# EAGLE design BigDaddy (EAGLE 8.4.3)
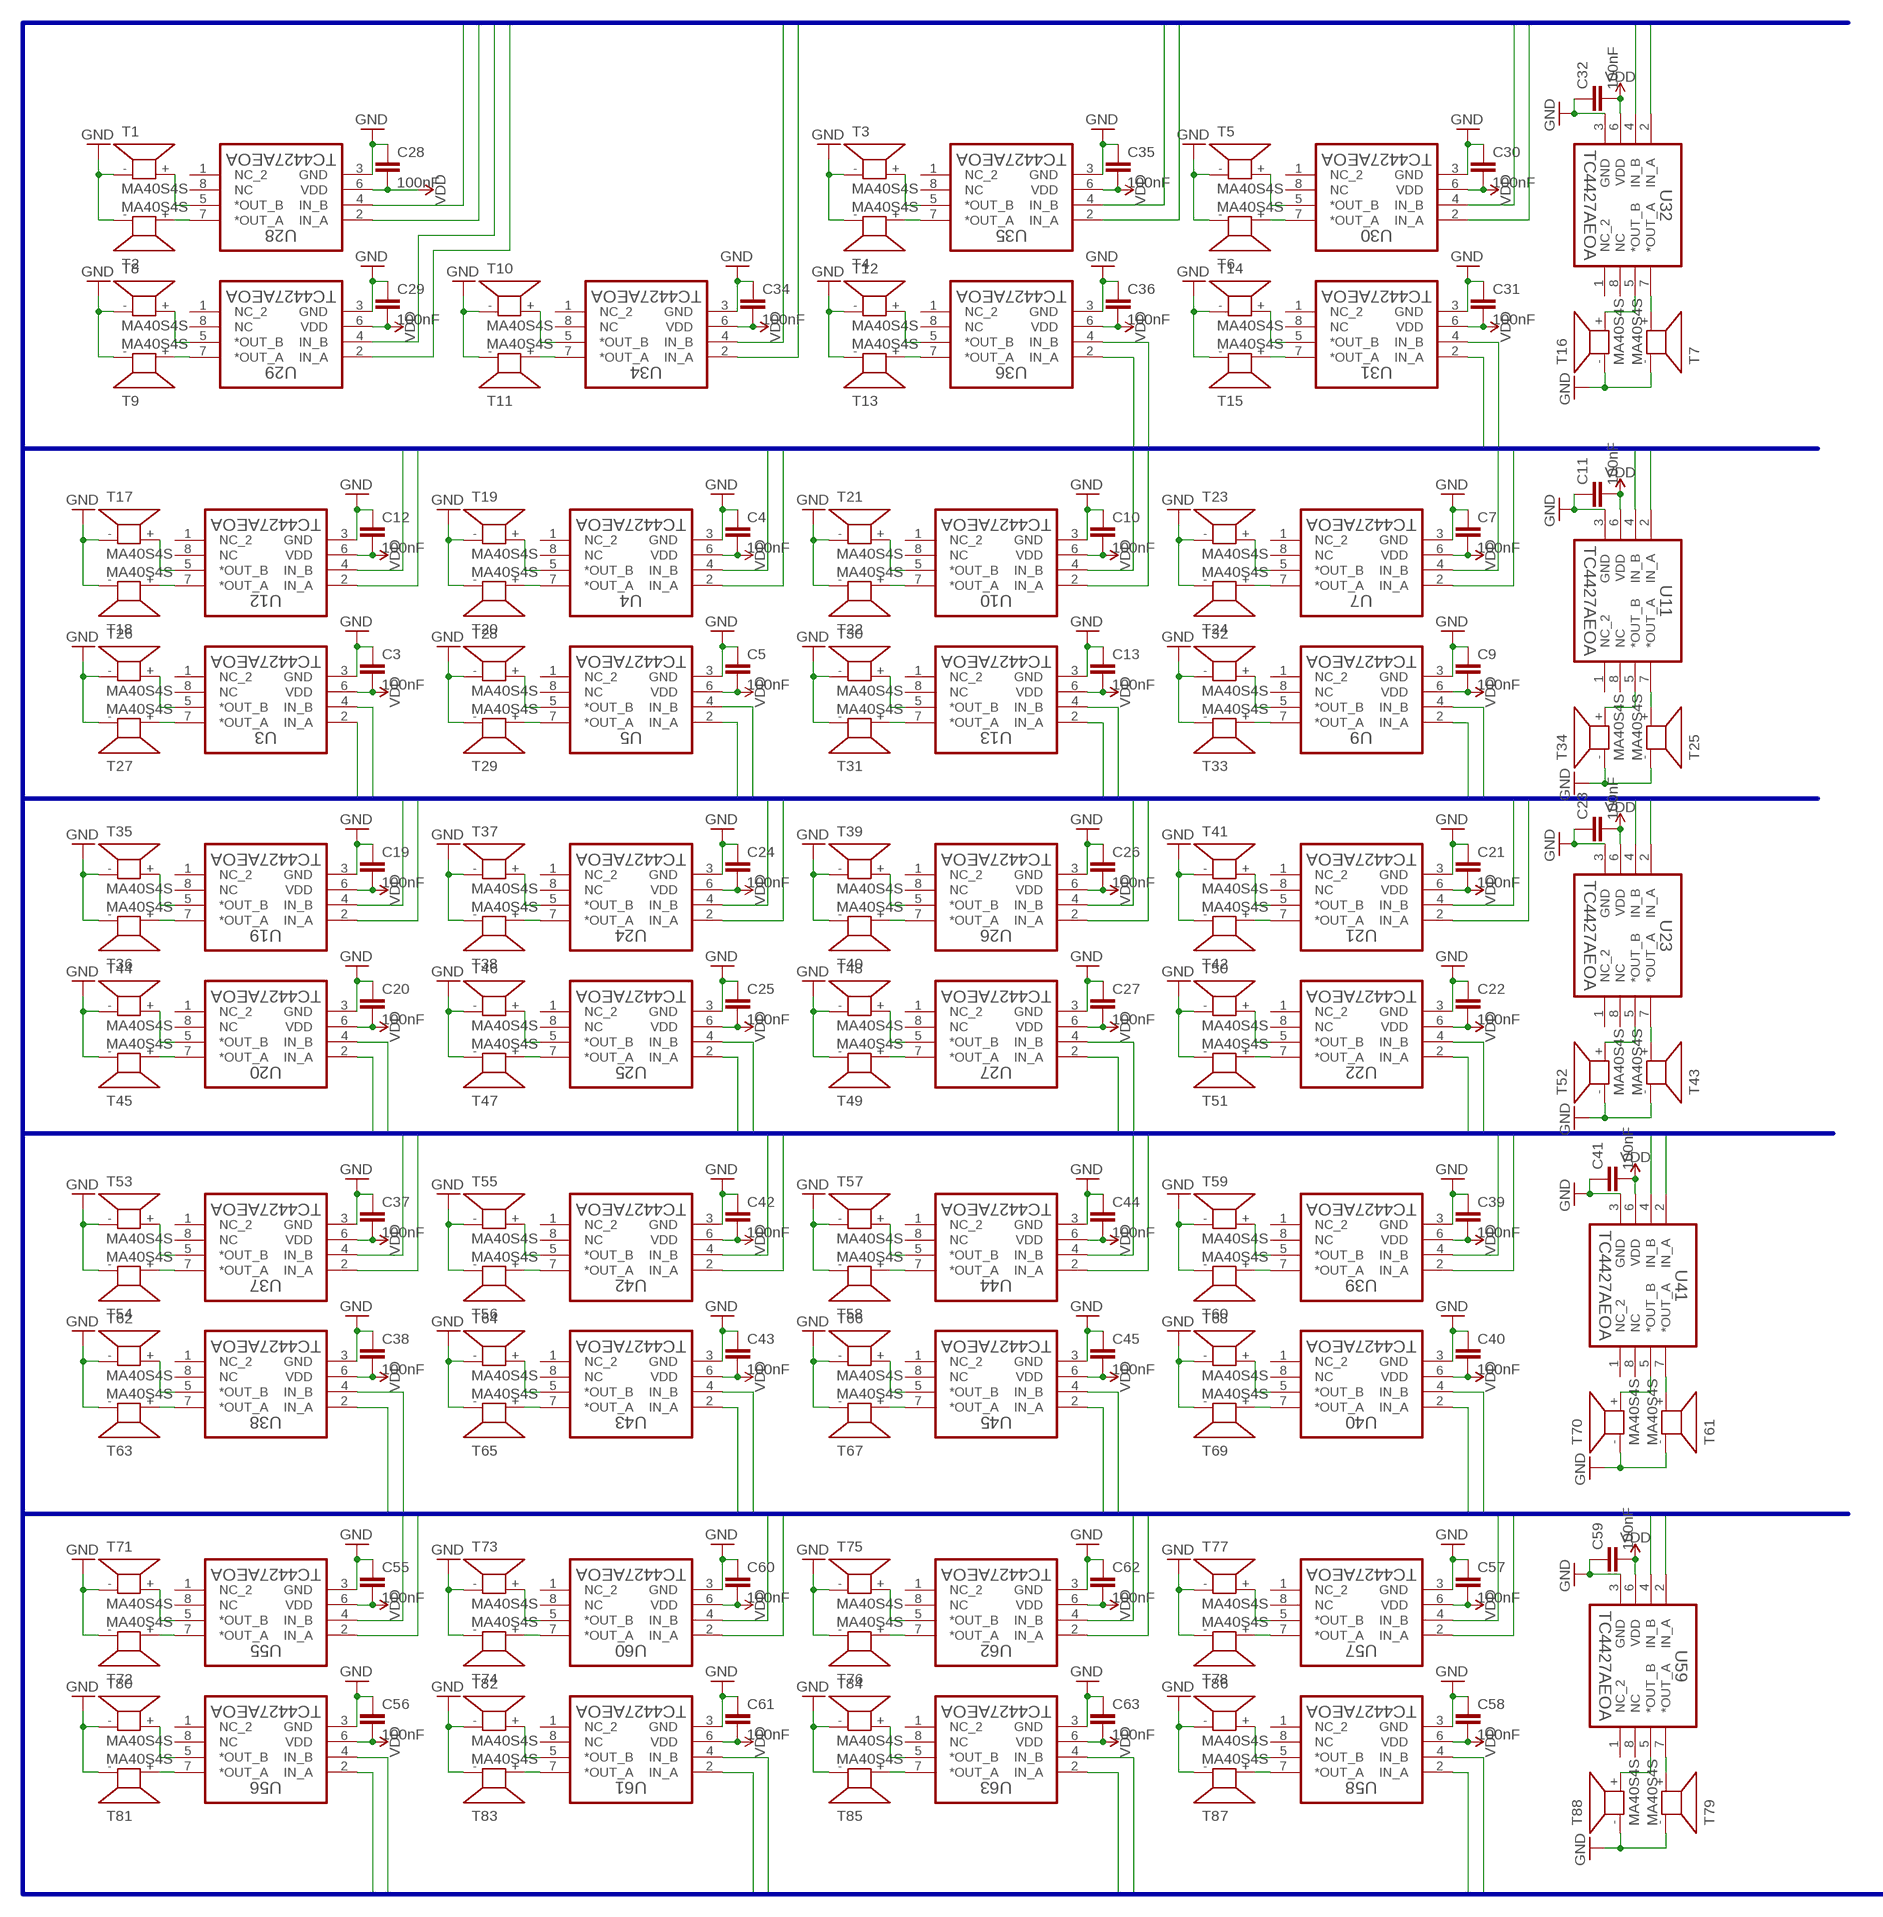
[diagram p0: schematic, sheet 1, part 1 of 2]
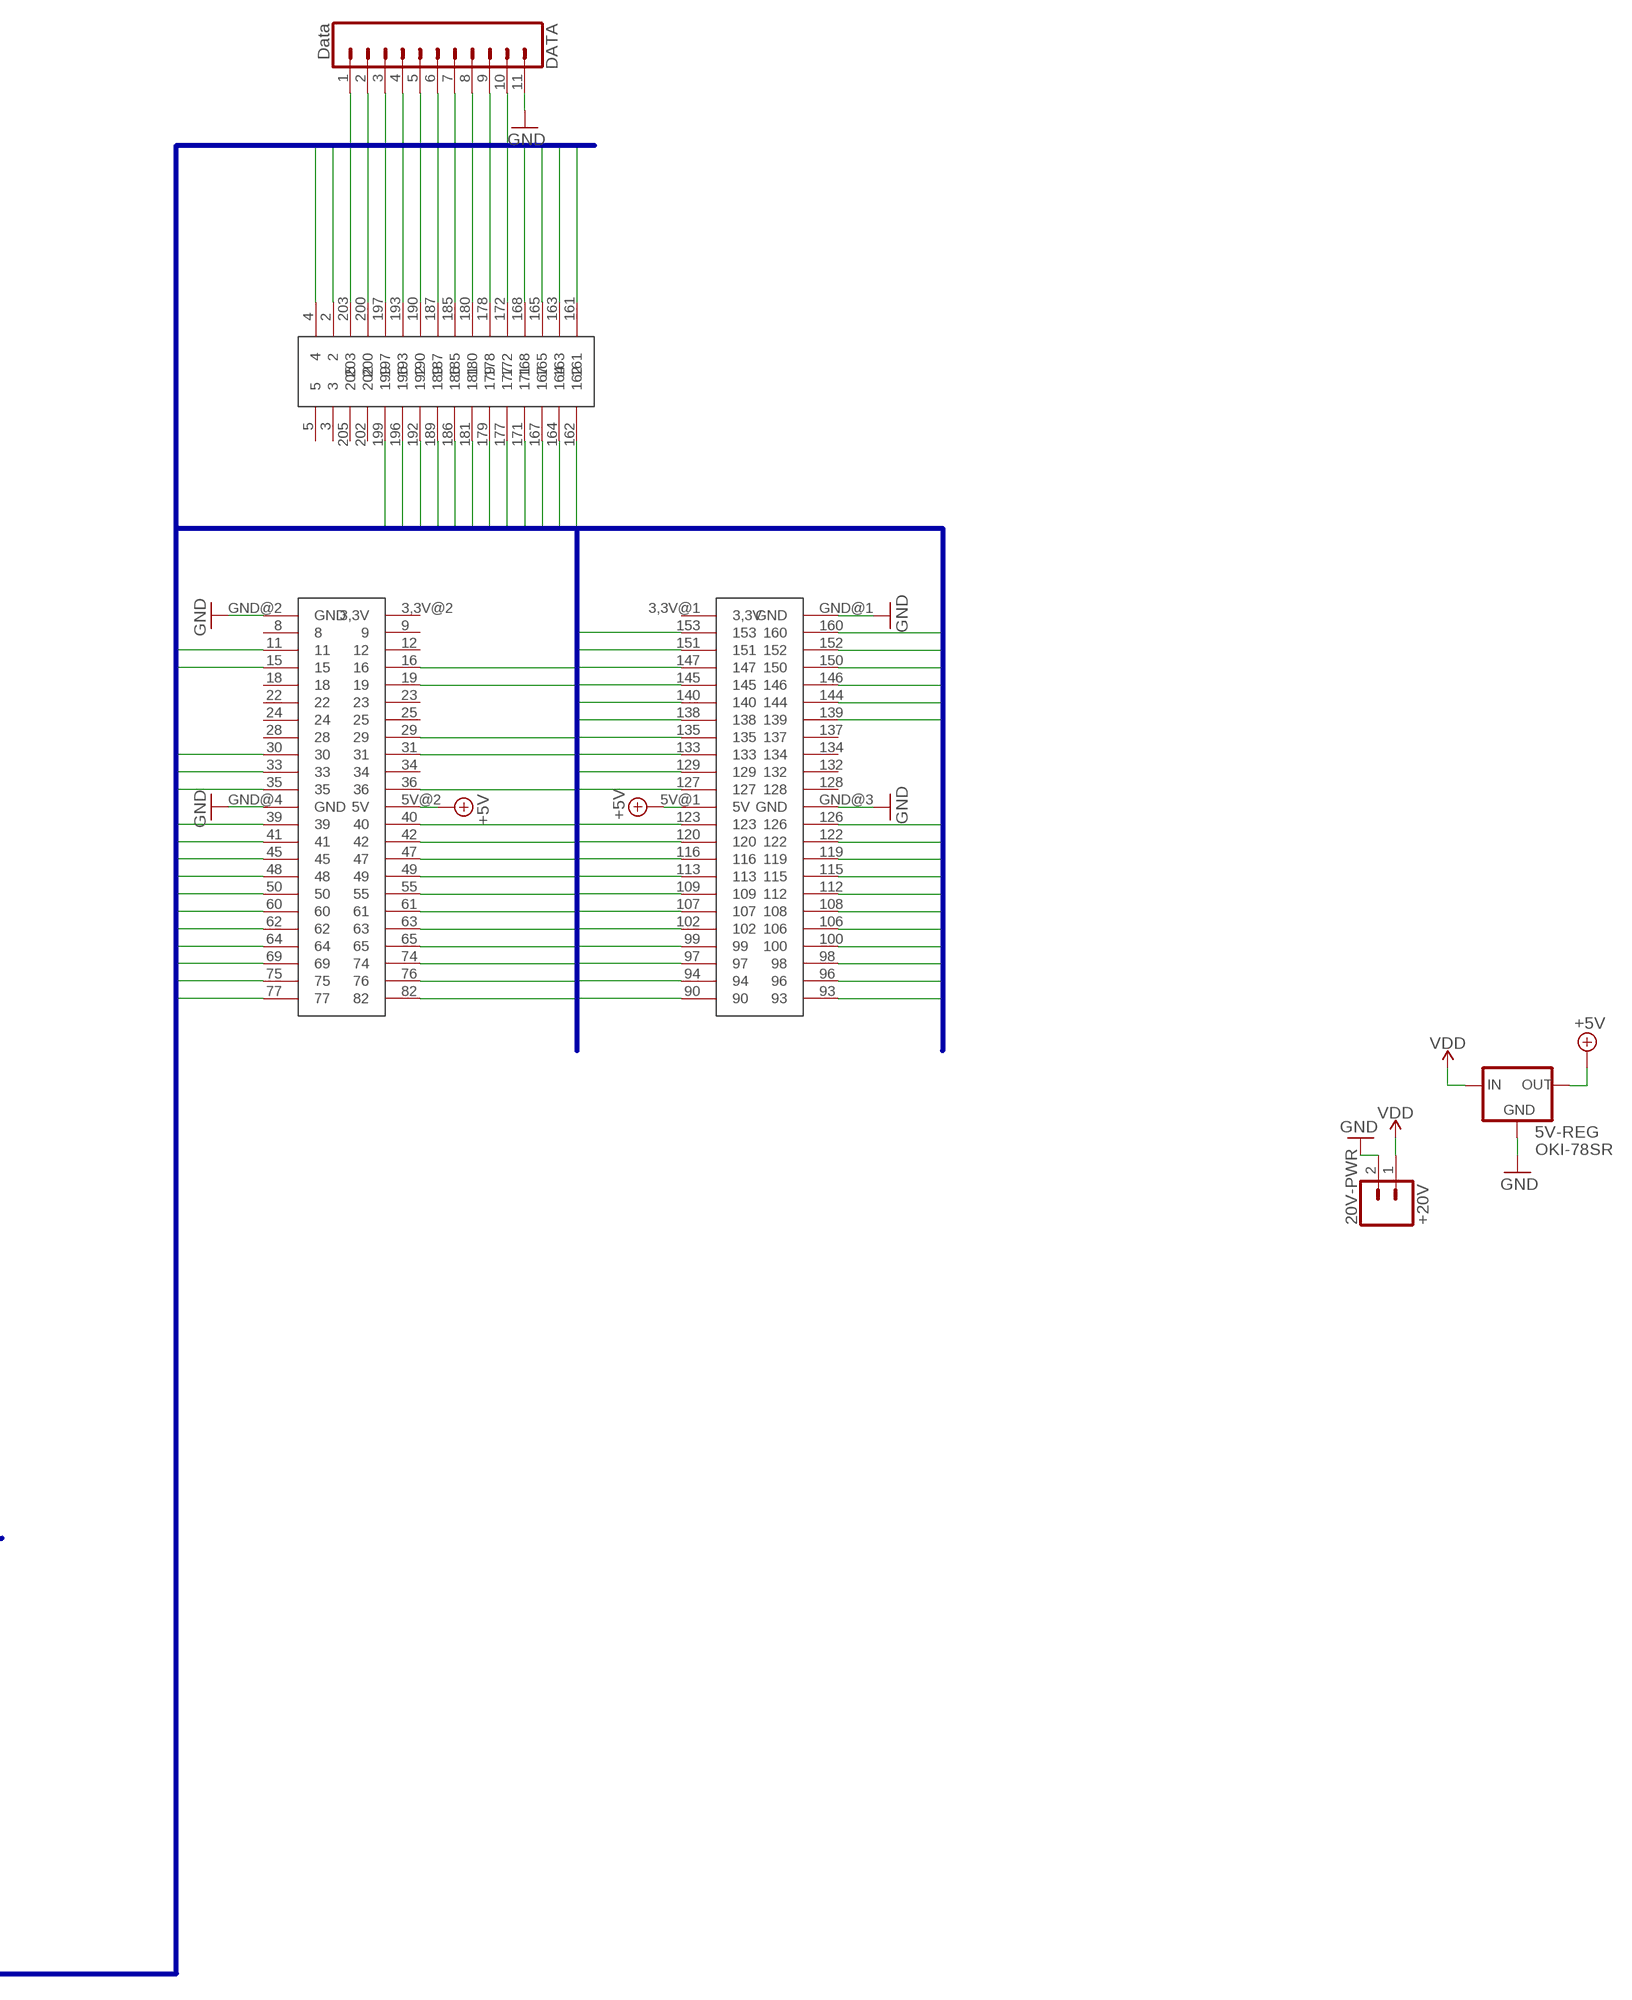
[diagram p1: schematic, sheet 1, part 2 of 2]

## Parts
5V-REG  OKI-78SR  [OKI-78SR-HORIZ]
20V-PWR  +20V  CONN_02LOCK_LONGPADS  [1X02_LOCK_LONGPADS]
C3  100nF  C-EUC0805  [C0805]
C4  100nF  C-EUC0805  [C0805]
C5  100nF  C-EUC0805  [C0805]
C7  100nF  C-EUC0805  [C0805]
C9  100nF  C-EUC0805  [C0805]
C10  100nF  C-EUC0805  [C0805]
C11  100nF  C-EUC0805  [C0805]
C12  100nF  C-EUC0805  [C0805]
C13  100nF  C-EUC0805  [C0805]
C19  100nF  C-EUC0805  [C0805]
C20  100nF  C-EUC0805  [C0805]
C21  100nF  C-EUC0805  [C0805]
C22  100nF  C-EUC0805  [C0805]
C23  100nF  C-EUC0805  [C0805]
C24  100nF  C-EUC0805  [C0805]
C25  100nF  C-EUC0805  [C0805]
C26  100nF  C-EUC0805  [C0805]
C27  100nF  C-EUC0805  [C0805]
C28  100nF  C-EUC0805  [C0805]
C29  100nF  C-EUC0805  [C0805]
C30  100nF  C-EUC0805  [C0805]
C31  100nF  C-EUC0805  [C0805]
C32  100nF  C-EUC0805  [C0805]
C34  100nF  C-EUC0805  [C0805]
C35  100nF  C-EUC0805  [C0805]
C36  100nF  C-EUC0805  [C0805]
C37  100nF  C-EUC0805  [C0805]
C38  100nF  C-EUC0805  [C0805]
C39  100nF  C-EUC0805  [C0805]
C40  100nF  C-EUC0805  [C0805]
C41  100nF  C-EUC0805  [C0805]
C42  100nF  C-EUC0805  [C0805]
C43  100nF  C-EUC0805  [C0805]
C44  100nF  C-EUC0805  [C0805]
C45  100nF  C-EUC0805  [C0805]
C55  100nF  C-EUC0805  [C0805]
C56  100nF  C-EUC0805  [C0805]
C57  100nF  C-EUC0805  [C0805]
C58  100nF  C-EUC0805  [C0805]
C59  100nF  C-EUC0805  [C0805]
C60  100nF  C-EUC0805  [C0805]
C61  100nF  C-EUC0805  [C0805]
C62  100nF  C-EUC0805  [C0805]
C63  100nF  C-EUC0805  [C0805]
DATA  Data  CONN_11  [1X11]
DIP1  CORE3S500ESMT  [CORE3S500E-SMT]
T1  MA40S4S  [MA40]
T2  MA40S4S  [MA40]
T3  MA40S4S  [MA40]
T4  MA40S4S  [MA40]
T5  MA40S4S  [MA40]
T6  MA40S4S  [MA40]
T7  MA40S4S  [MA40]
T8  MA40S4S  [MA40]
T9  MA40S4S  [MA40]
T10  MA40S4S  [MA40]
T11  MA40S4S  [MA40]
T12  MA40S4S  [MA40]
T13  MA40S4S  [MA40]
T14  MA40S4S  [MA40]
T15  MA40S4S  [MA40]
T16  MA40S4S  [MA40]
T17  MA40S4S  [MA40]
T18  MA40S4S  [MA40]
T19  MA40S4S  [MA40]
T20  MA40S4S  [MA40]
T21  MA40S4S  [MA40]
T22  MA40S4S  [MA40]
T23  MA40S4S  [MA40]
T24  MA40S4S  [MA40]
T25  MA40S4S  [MA40]
T26  MA40S4S  [MA40]
T27  MA40S4S  [MA40]
T28  MA40S4S  [MA40]
T29  MA40S4S  [MA40]
T30  MA40S4S  [MA40]
T31  MA40S4S  [MA40]
T32  MA40S4S  [MA40]
T33  MA40S4S  [MA40]
T34  MA40S4S  [MA40]
T35  MA40S4S  [MA40]
T36  MA40S4S  [MA40]
T37  MA40S4S  [MA40]
T38  MA40S4S  [MA40]
T39  MA40S4S  [MA40]
T40  MA40S4S  [MA40]
T41  MA40S4S  [MA40]
T42  MA40S4S  [MA40]
T43  MA40S4S  [MA40]
T44  MA40S4S  [MA40]
T45  MA40S4S  [MA40]
T46  MA40S4S  [MA40]
T47  MA40S4S  [MA40]
T48  MA40S4S  [MA40]
T49  MA40S4S  [MA40]
T50  MA40S4S  [MA40]
T51  MA40S4S  [MA40]
T52  MA40S4S  [MA40]
T53  MA40S4S  [MA40]
T54  MA40S4S  [MA40]
T55  MA40S4S  [MA40]
T56  MA40S4S  [MA40]
T57  MA40S4S  [MA40]
T58  MA40S4S  [MA40]
T59  MA40S4S  [MA40]
T60  MA40S4S  [MA40]
T61  MA40S4S  [MA40]
T62  MA40S4S  [MA40]
T63  MA40S4S  [MA40]
T64  MA40S4S  [MA40]
T65  MA40S4S  [MA40]
T66  MA40S4S  [MA40]
T67  MA40S4S  [MA40]
T68  MA40S4S  [MA40]
T69  MA40S4S  [MA40]
T70  MA40S4S  [MA40]
T71  MA40S4S  [MA40]
T72  MA40S4S  [MA40]
T73  MA40S4S  [MA40]
T74  MA40S4S  [MA40]
T75  MA40S4S  [MA40]
T76  MA40S4S  [MA40]
T77  MA40S4S  [MA40]
T78  MA40S4S  [MA40]
T79  MA40S4S  [MA40]
T80  MA40S4S  [MA40]
T81  MA40S4S  [MA40]
T82  MA40S4S  [MA40]
T83  MA40S4S  [MA40]
T84  MA40S4S  [MA40]
T85  MA40S4S  [MA40]
T86  MA40S4S  [MA40]
T87  MA40S4S  [MA40]
T88  MA40S4S  [MA40]
U3  TC4427AEOA  [SOIC127P600X175-8N]
U4  TC4427AEOA  [SOIC127P600X175-8N]
U5  TC4427AEOA  [SOIC127P600X175-8N]
U7  TC4427AEOA  [SOIC127P600X175-8N]
U9  TC4427AEOA  [SOIC127P600X175-8N]
U10  TC4427AEOA  [SOIC127P600X175-8N]
U11  TC4427AEOA  [SOIC127P600X175-8N]
U12  TC4427AEOA  [SOIC127P600X175-8N]
U13  TC4427AEOA  [SOIC127P600X175-8N]
U19  TC4427AEOA  [SOIC127P600X175-8N]
U20  TC4427AEOA  [SOIC127P600X175-8N]
U21  TC4427AEOA  [SOIC127P600X175-8N]
U22  TC4427AEOA  [SOIC127P600X175-8N]
U23  TC4427AEOA  [SOIC127P600X175-8N]
U24  TC4427AEOA  [SOIC127P600X175-8N]
U25  TC4427AEOA  [SOIC127P600X175-8N]
U26  TC4427AEOA  [SOIC127P600X175-8N]
U27  TC4427AEOA  [SOIC127P600X175-8N]
U28  TC4427AEOA  [SOIC127P600X175-8N]
U29  TC4427AEOA  [SOIC127P600X175-8N]
U30  TC4427AEOA  [SOIC127P600X175-8N]
U31  TC4427AEOA  [SOIC127P600X175-8N]
U32  TC4427AEOA  [SOIC127P600X175-8N]
U34  TC4427AEOA  [SOIC127P600X175-8N]
U35  TC4427AEOA  [SOIC127P600X175-8N]
U36  TC4427AEOA  [SOIC127P600X175-8N]
U37  TC4427AEOA  [SOIC127P600X175-8N]
U38  TC4427AEOA  [SOIC127P600X175-8N]
U39  TC4427AEOA  [SOIC127P600X175-8N]
U40  TC4427AEOA  [SOIC127P600X175-8N]
U41  TC4427AEOA  [SOIC127P600X175-8N]
U42  TC4427AEOA  [SOIC127P600X175-8N]
U43  TC4427AEOA  [SOIC127P600X175-8N]
U44  TC4427AEOA  [SOIC127P600X175-8N]
U45  TC4427AEOA  [SOIC127P600X175-8N]
U55  TC4427AEOA  [SOIC127P600X175-8N]
U56  TC4427AEOA  [SOIC127P600X175-8N]
U57  TC4427AEOA  [SOIC127P600X175-8N]
U58  TC4427AEOA  [SOIC127P600X175-8N]
U59  TC4427AEOA  [SOIC127P600X175-8N]
U60  TC4427AEOA  [SOIC127P600X175-8N]
U61  TC4427AEOA  [SOIC127P600X175-8N]
U62  TC4427AEOA  [SOIC127P600X175-8N]
U63  TC4427AEOA  [SOIC127P600X175-8N]

## Nets
1: DIP1.2 U28.4(IN_B)
2: DIP1.4 U28.2(IN_A)
3: DIP1.165 U35.4(IN_B)
4: DIP1.168 U35.2(IN_A)
5: DIP1.163 U30.4(IN_B)
6: DIP1.161 U30.2(IN_A)
7: DIP1.162 U32.2(IN_A)
8: DIP1.196 U29.4(IN_B)
9: DIP1.199 U29.2(IN_A)
10: DIP1.192 U34.4(IN_B)
11: DIP1.189 U34.2(IN_A)
12: DIP1.177 U36.4(IN_B)
13: DIP1.179 U36.2(IN_A)
14: DIP1.171 U31.4(IN_B)
15: DIP1.167 U31.2(IN_A)
16: DIP1.164 U32.4(IN_B)
17: DIP1.11 U12.4(IN_B)
18: DIP1.15 U12.2(IN_A)
19: DIP1.19 U4.4(IN_B)
20: DIP1.16 U4.2(IN_A)
21: DIP1.186 U10.4(IN_B)
22: DIP1.181 U10.2(IN_A)
23: DIP1.152 U7.4(IN_B)
24: DIP1.160 U7.2(IN_A)
25: DIP1.150 U11.2(IN_A)
26: DIP1.30 U3.4(IN_B)
27: DIP1.33 U3.2(IN_A)
28: DIP1.31 U5.4(IN_B)
29: DIP1.29 U5.2(IN_A)
30: DIP1.153 U13.4(IN_B)
31: DIP1.151 U13.2(IN_A)
32: DIP1.139 U9.4(IN_B)
33: DIP1.144 U9.2(IN_A)
34: DIP1.146 U11.4(IN_B)
35: DIP1.35 U19.4(IN_B)
36: DIP1.39 U19.2(IN_A)
37: DIP1.40 U24.4(IN_B)
38: DIP1.36 U24.2(IN_A)
39: DIP1.147 U26.4(IN_B)
40: DIP1.145 U26.2(IN_A)
41: DIP1.122 U21.4(IN_B)
42: DIP1.126 U21.2(IN_A)
43: DIP1.119 U23.2(IN_A)
44: DIP1.41 U20.4(IN_B)
45: DIP1.45 U20.2(IN_A)
46: DIP1.47 U25.4(IN_B)
47: DIP1.42 U25.2(IN_A)
48: DIP1.140 U27.4(IN_B)
49: DIP1.138 U27.2(IN_A)
50: DIP1.108 U22.4(IN_B)
51: DIP1.112 U22.2(IN_A)
52: DIP1.115 U23.4(IN_B)
53: DIP1.48 U37.4(IN_B)
54: DIP1.50 U37.2(IN_A)
55: DIP1.55 U42.4(IN_B)
56: DIP1.49 U42.2(IN_A)
57: DIP1.135 U44.4(IN_B)
58: DIP1.133 U44.2(IN_A)
59: DIP1.100 U39.4(IN_B)
60: DIP1.106 U39.2(IN_A)
61: DIP1.98 U41.2(IN_A)
62: DIP1.77 U38.4(IN_B)
63: DIP1.75 U38.2(IN_A)
64: DIP1.63 U43.4(IN_B)
65: DIP1.61 U43.2(IN_A)
66: DIP1.129 U45.4(IN_B)
67: DIP1.127 U45.2(IN_A)
68: DIP1.109 U40.4(IN_B)
69: DIP1.93 U40.2(IN_A)
70: DIP1.96 U41.4(IN_B)
71: DIP1.69 U55.4(IN_B)
72: DIP1.64 U55.2(IN_A)
73: DIP1.74 U60.4(IN_B)
74: DIP1.65 U60.2(IN_A)
75: DIP1.123 U62.4(IN_B)
76: DIP1.120 U62.2(IN_A)
77: DIP1.102 U57.4(IN_B)
78: DIP1.107 U57.2(IN_A)
79: DIP1.99 U59.2(IN_A)
80: DIP1.62 U56.4(IN_B)
81: DIP1.60 U56.2(IN_A)
82: DIP1.82 U61.4(IN_B)
83: DIP1.76 U61.2(IN_A)
84: DIP1.116 U63.4(IN_B)
85: DIP1.113 U63.2(IN_A)
86: DIP1.94 U58.4(IN_B)
87: DIP1.90 U58.2(IN_A)
88: DIP1.97 U59.4(IN_B)
+5V: 5V-REG.OUT DIP1.5V@1(5V) DIP1.5V@2(5V)
GND: 5V-REG.GND 20V-PWR.2 C3.1 C4.1 C5.1 C7.1 C9.1 C10.1 C11.1 C12.1 C13.1 C19.1 C20.1 C21.1 C22.1 C23.1 C24.1 C25.1 C26.1 C27.1 C28.1 C29.1 C30.1 C31.1 C32.1 C34.1 C35.1 C36.1 C37.1 C38.1 C39.1 C40.1 C41.1 C42.1 C43.1 C44.1 C45.1 C55.1 C56.1 C57.1 C58.1 C59.1 C60.1 C61.1 C62.1 C63.1 DATA.11 DIP1.GND@1(GND) DIP1.GND@2(GND) DIP1.GND@3(GND) DIP1.GND@4(GND) T1.- T2.- T3.- T4.- T5.- T6.- T7.- T8.- T9.- T10.- T11.- T12.- T13.- T14.- T15.- T16.- T17.- T18.- T19.- T20.- T21.- T22.- T23.- T24.- T25.- T26.- T27.- T28.- T29.- T30.- T31.- T32.- T33.- T34.- T35.- T36.- T37.- T38.- T39.- T40.- T41.- T42.- T43.- T44.- T45.- T46.- T47.- T48.- T49.- T50.- T51.- T52.- T53.- T54.- T55.- T56.- T57.- T58.- T59.- T60.- T61.- T62.- T63.- T64.- T65.- T66.- T67.- T68.- T69.- T70.- T71.- T72.- T73.- T74.- T75.- T76.- T77.- T78.- T79.- T80.- T81.- T82.- T83.- T84.- T85.- T86.- T87.- T88.- U3.3(GND) U4.3(GND) U5.3(GND) U7.3(GND) U9.3(GND) U10.3(GND) U11.3(GND) U12.3(GND) U13.3(GND) U19.3(GND) U20.3(GND) U21.3(GND) U22.3(GND) U23.3(GND) U24.3(GND) U25.3(GND) U26.3(GND) U27.3(GND) U28.3(GND) U29.3(GND) U30.3(GND) U31.3(GND) U32.3(GND) U34.3(GND) U35.3(GND) U36.3(GND) U37.3(GND) U38.3(GND) U39.3(GND) U40.3(GND) U41.3(GND) U42.3(GND) U43.3(GND) U44.3(GND) U45.3(GND) U55.3(GND) U56.3(GND) U57.3(GND) U58.3(GND) U59.3(GND) U60.3(GND) U61.3(GND) U62.3(GND) U63.3(GND)
N$1: DATA.1 DIP1.203
N$2: DATA.2 DIP1.200
N$3: DATA.3 DIP1.197
N$4: DATA.4 DIP1.193
N$5: T27.+ U3.7(*OUT_A)
N$6: T26.+ U3.5(*OUT_B)
N$7: T20.+ U4.7(*OUT_A)
N$8: T19.+ U4.5(*OUT_B)
N$9: T29.+ U5.7(*OUT_A)
N$10: T28.+ U5.5(*OUT_B)
N$13: DATA.5 DIP1.190
N$14: DATA.6 DIP1.187
N$15: T24.+ U7.7(*OUT_A)
N$16: T23.+ U7.5(*OUT_B)
N$17: DATA.7 DIP1.185
N$18: DATA.8 DIP1.180
N$19: T33.+ U9.7(*OUT_A)
N$20: T32.+ U9.5(*OUT_B)
N$21: T22.+ U10.7(*OUT_A)
N$22: T21.+ U10.5(*OUT_B)
N$23: T25.+ U11.7(*OUT_A)
N$24: T34.+ U11.5(*OUT_B)
N$25: T18.+ U12.7(*OUT_A)
N$26: T17.+ U12.5(*OUT_B)
N$27: T31.+ U13.7(*OUT_A)
N$28: T30.+ U13.5(*OUT_B)
N$29: DATA.9 DIP1.178
N$30: DATA.10 DIP1.172
N$39: T36.+ U19.7(*OUT_A)
N$40: T35.+ U19.5(*OUT_B)
N$41: T45.+ U20.7(*OUT_A)
N$42: T44.+ U20.5(*OUT_B)
N$43: T42.+ U21.7(*OUT_A)
N$44: T41.+ U21.5(*OUT_B)
N$45: T51.+ U22.7(*OUT_A)
N$46: T50.+ U22.5(*OUT_B)
N$47: T43.+ U23.7(*OUT_A)
N$48: T52.+ U23.5(*OUT_B)
N$49: T38.+ U24.7(*OUT_A)
N$50: T37.+ U24.5(*OUT_B)
N$51: T47.+ U25.7(*OUT_A)
N$52: T46.+ U25.5(*OUT_B)
N$53: T40.+ U26.7(*OUT_A)
N$54: T39.+ U26.5(*OUT_B)
N$55: T49.+ U27.7(*OUT_A)
N$56: T48.+ U27.5(*OUT_B)
N$57: T2.+ U28.7(*OUT_A)
N$58: T1.+ U28.5(*OUT_B)
N$59: T9.+ U29.7(*OUT_A)
N$60: T8.+ U29.5(*OUT_B)
N$61: T6.+ U30.7(*OUT_A)
N$62: T5.+ U30.5(*OUT_B)
N$63: T15.+ U31.7(*OUT_A)
N$64: T14.+ U31.5(*OUT_B)
N$65: T7.+ U32.7(*OUT_A)
N$66: T16.+ U32.5(*OUT_B)
N$69: T11.+ U34.7(*OUT_A)
N$70: T10.+ U34.5(*OUT_B)
N$71: T4.+ U35.7(*OUT_A)
N$72: T3.+ U35.5(*OUT_B)
N$73: T13.+ U36.7(*OUT_A)
N$74: T12.+ U36.5(*OUT_B)
N$75: T54.+ U37.7(*OUT_A)
N$76: T53.+ U37.5(*OUT_B)
N$77: T63.+ U38.7(*OUT_A)
N$78: T62.+ U38.5(*OUT_B)
N$79: T60.+ U39.7(*OUT_A)
N$80: T59.+ U39.5(*OUT_B)
N$81: T69.+ U40.7(*OUT_A)
N$82: T68.+ U40.5(*OUT_B)
N$83: T61.+ U41.7(*OUT_A)
N$84: T70.+ U41.5(*OUT_B)
N$85: T56.+ U42.7(*OUT_A)
N$86: T55.+ U42.5(*OUT_B)
N$87: T65.+ U43.7(*OUT_A)
N$88: T64.+ U43.5(*OUT_B)
N$89: T58.+ U44.7(*OUT_A)
N$90: T57.+ U44.5(*OUT_B)
N$91: T67.+ U45.7(*OUT_A)
N$92: T66.+ U45.5(*OUT_B)
N$111: T72.+ U55.7(*OUT_A)
N$112: T71.+ U55.5(*OUT_B)
N$113: T81.+ U56.7(*OUT_A)
N$114: T80.+ U56.5(*OUT_B)
N$115: T78.+ U57.7(*OUT_A)
N$116: T77.+ U57.5(*OUT_B)
N$117: T87.+ U58.7(*OUT_A)
N$118: T86.+ U58.5(*OUT_B)
N$119: T79.+ U59.7(*OUT_A)
N$120: T88.+ U59.5(*OUT_B)
N$121: T74.+ U60.7(*OUT_A)
N$122: T73.+ U60.5(*OUT_B)
N$123: T83.+ U61.7(*OUT_A)
N$124: T82.+ U61.5(*OUT_B)
N$125: T76.+ U62.7(*OUT_A)
N$126: T75.+ U62.5(*OUT_B)
N$127: T85.+ U63.7(*OUT_A)
N$128: T84.+ U63.5(*OUT_B)
VDD: 5V-REG.IN 20V-PWR.1 C3.2 C4.2 C5.2 C7.2 C9.2 C10.2 C11.2 C12.2 C13.2 C19.2 C20.2 C21.2 C22.2 C23.2 C24.2 C25.2 C26.2 C27.2 C28.2 C29.2 C30.2 C31.2 C32.2 C34.2 C35.2 C36.2 C37.2 C38.2 C39.2 C40.2 C41.2 C42.2 C43.2 C44.2 C45.2 C55.2 C56.2 C57.2 C58.2 C59.2 C60.2 C61.2 C62.2 C63.2 U3.6(VDD) U4.6(VDD) U5.6(VDD) U7.6(VDD) U9.6(VDD) U10.6(VDD) U11.6(VDD) U12.6(VDD) U13.6(VDD) U19.6(VDD) U20.6(VDD) U21.6(VDD) U22.6(VDD) U23.6(VDD) U24.6(VDD) U25.6(VDD) U26.6(VDD) U27.6(VDD) U28.6(VDD) U29.6(VDD) U30.6(VDD) U31.6(VDD) U32.6(VDD) U34.6(VDD) U35.6(VDD) U36.6(VDD) U37.6(VDD) U38.6(VDD) U39.6(VDD) U40.6(VDD) U41.6(VDD) U42.6(VDD) U43.6(VDD) U44.6(VDD) U45.6(VDD) U55.6(VDD) U56.6(VDD) U57.6(VDD) U58.6(VDD) U59.6(VDD) U60.6(VDD) U61.6(VDD) U62.6(VDD) U63.6(VDD)
Unconnected: DIP1.3 DIP1.3,3V@1(3,3V) DIP1.3,3V@2(3,3V) DIP1.5 DIP1.8 DIP1.9 DIP1.12 DIP1.18 DIP1.22 DIP1.23 DIP1.24 DIP1.25 DIP1.28 DIP1.34 DIP1.128 DIP1.132 DIP1.134 DIP1.137 DIP1.202 DIP1.205 U3.1(NC_2) U3.8(NC) U4.1(NC_2) U4.8(NC) U5.1(NC_2) U5.8(NC) U7.1(NC_2) U7.8(NC) U9.1(NC_2) U9.8(NC) U10.1(NC_2) U10.8(NC) U11.1(NC_2) U11.8(NC) U12.1(NC_2) U12.8(NC) U13.1(NC_2) U13.8(NC) U19.1(NC_2) U19.8(NC) U20.1(NC_2) U20.8(NC) U21.1(NC_2) U21.8(NC) U22.1(NC_2) U22.8(NC) U23.1(NC_2) U23.8(NC) U24.1(NC_2) U24.8(NC) U25.1(NC_2) U25.8(NC) U26.1(NC_2) U26.8(NC) U27.1(NC_2) U27.8(NC) U28.1(NC_2) U28.8(NC) U29.1(NC_2) U29.8(NC) U30.1(NC_2) U30.8(NC) U31.1(NC_2) U31.8(NC) U32.1(NC_2) U32.8(NC) U34.1(NC_2) U34.8(NC) U35.1(NC_2) U35.8(NC) U36.1(NC_2) U36.8(NC) U37.1(NC_2) U37.8(NC) U38.1(NC_2) U38.8(NC) U39.1(NC_2) U39.8(NC) U40.1(NC_2) U40.8(NC) U41.1(NC_2) U41.8(NC) U42.1(NC_2) U42.8(NC) U43.1(NC_2) U43.8(NC) U44.1(NC_2) U44.8(NC) U45.1(NC_2) U45.8(NC) U55.1(NC_2) U55.8(NC) U56.1(NC_2) U56.8(NC) U57.1(NC_2) U57.8(NC) U58.1(NC_2) U58.8(NC) U59.1(NC_2) U59.8(NC) U60.1(NC_2) U60.8(NC) U61.1(NC_2) U61.8(NC) U62.1(NC_2) U62.8(NC) U63.1(NC_2) U63.8(NC)

## Buses
1,2,3,4,5,6,7,8,9,10,11,12,13,14,15,16,17,18,19,20,21,22,23,24,25,26,27,28,29,30,31,32,33,34,35,36,37,38,39,40,41,42,43,44,45,46,47,48,49,50,51,52,53,54,55,56,57,58,59,60,61,62,63,64,65,66,67,68,69,70,71,72,73,74,75,76,77,78,79,80,81,82,83,84,85,86,87,88

## Library data of the parts
5V-REG = Parts:OKI-78SR
20V-PWR = SparkFun-Connectors:CONN_02: Multi connection point. Often used as Generic Header-pin footprint for 0.1 inch spaced/style header connections On any of the 0.1 inch spaced packages, you can populate with these: Break Away Headers - Straight <https://www.sparkfun.com/products/116> (PRT-00116) Break Away Male Headers - Right Angle <https://www.sparkfun.com/products/553> (PRT-00553) Female Headers <https://www.sparkfun.com/products/115> (PRT-00115) Break Away Headers - Machine Pin <https://www.sparkfun.com/products/117> (PRT-00117) Break Away Female Headers - Swiss Machine Pin <https://www.sparkfun.com/products/743> (PRT-00743) For SCREWTERMINALS and SPRING TERMINALS visit here: Screw Terimnals on SparkFun.com <https://www.sparkfun.com/search/results?term=Screw+Terminals> (5mm/3.5mm/2.54mm spacing) This device is also useful as a general connection point to wire up your design to another part of your project. Our various solder wires solder well into these plated through hole pads. Hook-Up Wire - Assortment (Stranded, 22 AWG) <https://www.sparkfun.com/products/11375> (PRT-11375) Hook-Up Wire - Assortment (Solid Core, 22 AWG) <https://www.sparkfun.com/products/11367> (PRT-11367) View the entire wire category on our website here <https://www.sparkfun.com/categories/141> Special notes: Molex polarized connector foot print use with: PRT-08233 with associated crimp pins and housings. 2.54_SCREWTERM for use with PRT-10571. 3.5mm Screw Terminal footprints for PRT-08084 5mm Screw Terminal footprints for use with PRT-08432
C3-C5 C7 C9-C13 C19-C32 C34-C45 C55-C63 = resistor:C-EU: CAPACITOR, European symbol
DATA = SparkFun-Connectors:CONN_11: Multi connection point. Often used as Generic Header-pin footprint for 0.1 inch spaced/style header connections On any of the 0.1 inch spaced packages, you can populate with these: Break Away Headers - Straight <https://www.sparkfun.com/products/116> (PRT-00116) Break Away Male Headers - Right Angle <https://www.sparkfun.com/products/553> (PRT-00553) Female Headers <https://www.sparkfun.com/products/115> (PRT-00115) Break Away Headers - Machine Pin <https://www.sparkfun.com/products/117> (PRT-00117) Break Away Female Headers - Swiss Machine Pin <https://www.sparkfun.com/products/743> (PRT-00743) For SCREWTERMINALS and SPRING TERMINALS visit here: Screw Terimnals on SparkFun.com <https://www.sparkfun.com/search/results?term=Screw+Terminals> (5mm/3.5mm/2.54mm spacing) This device is also useful as a general connection point to wire up your design to another part of your project. Our various solder wires solder well into these plated through hole pads. Hook-Up Wire - Assortment (Stranded, 22 AWG) <https://www.sparkfun.com/products/11375> (PRT-11375) Hook-Up Wire - Assortment (Solid Core, 22 AWG) <https://www.sparkfun.com/products/11367> (PRT-11367) View the entire wire category on our website here <https://www.sparkfun.com/categories/141>
DIP1 = Parts:CORE3S500E: A Xilinx Spartan 3E FPGA module.
T1-T88 = Parts:MA40S4S: SPEAKER Source: Buerklin
U3-U5 U7 U9-U13 U19-U32 U34-U45 U55-U63 = Parts:TC4427AEOA: IC, MOSFET DRIVER, LOW SIDE; MPN: TC4427AEOA; OC_FARNELL: 1292285; OC_NEWARK: 96K4020; PACKAGE: SOIC-8; SUPPLIER: Microchip

## Board
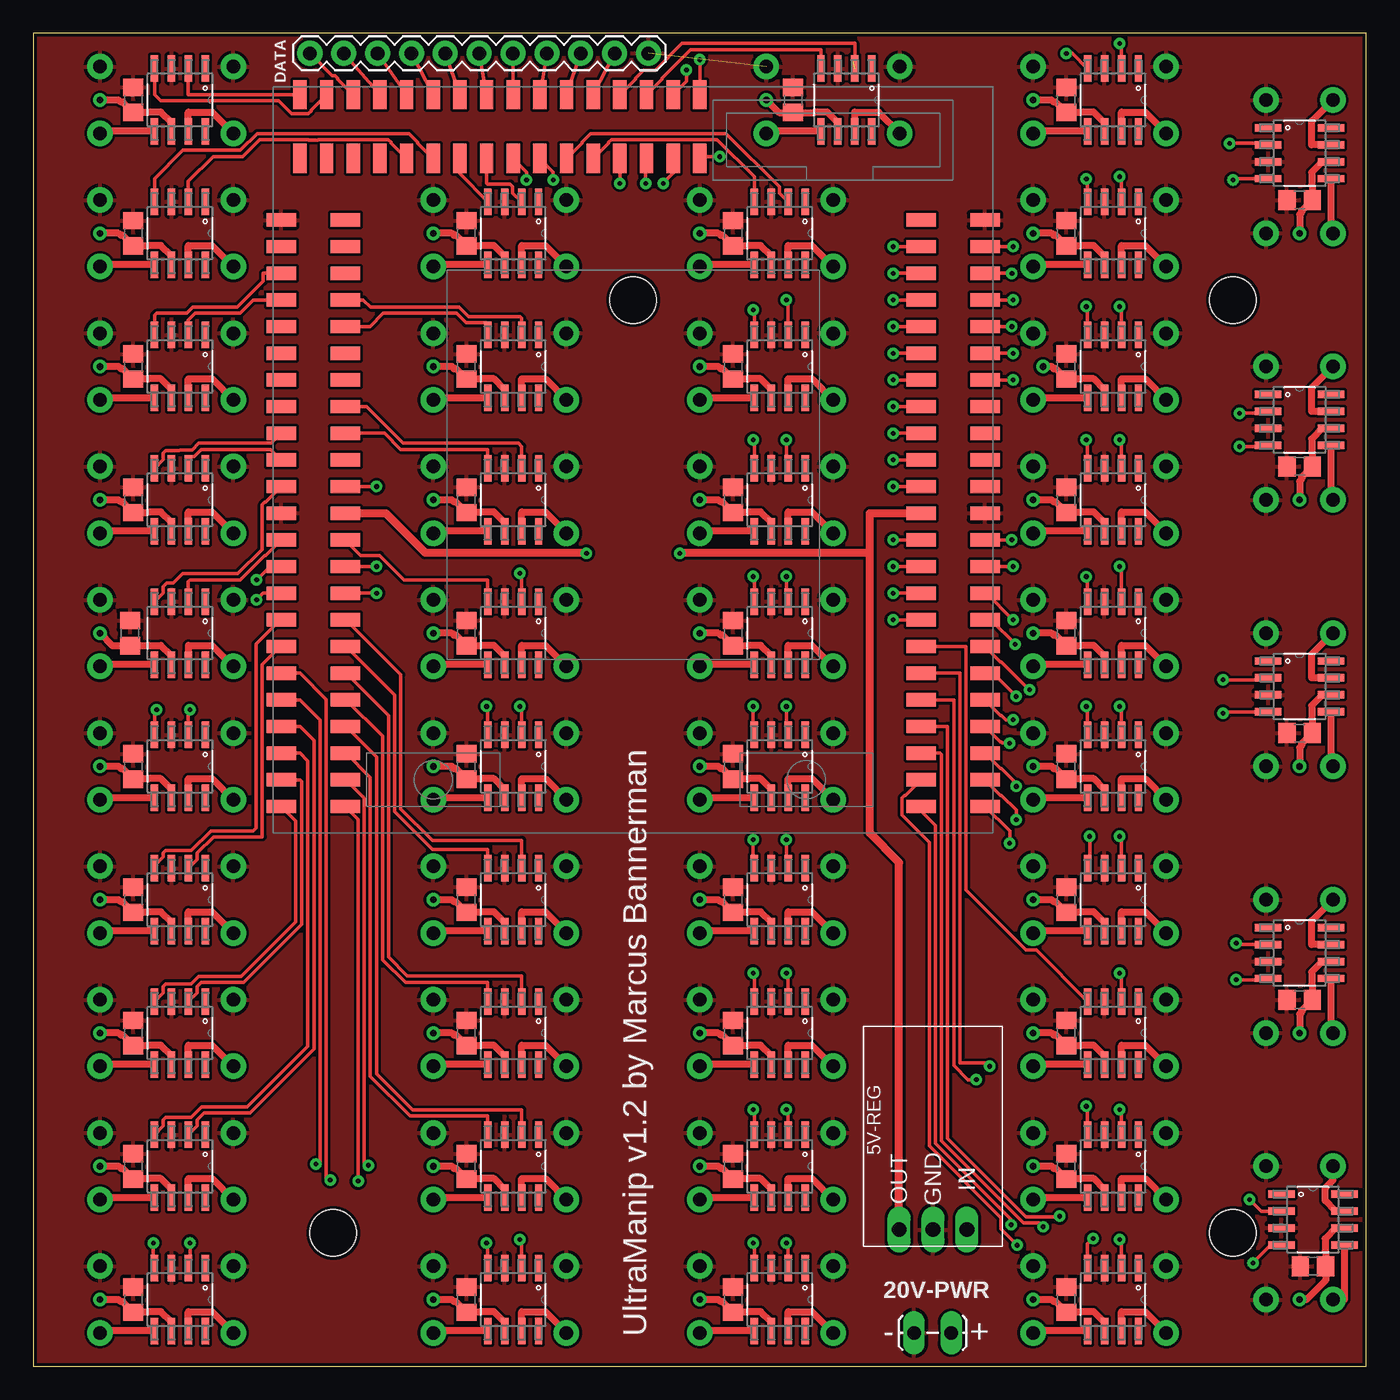
[diagram p2: board, top side]
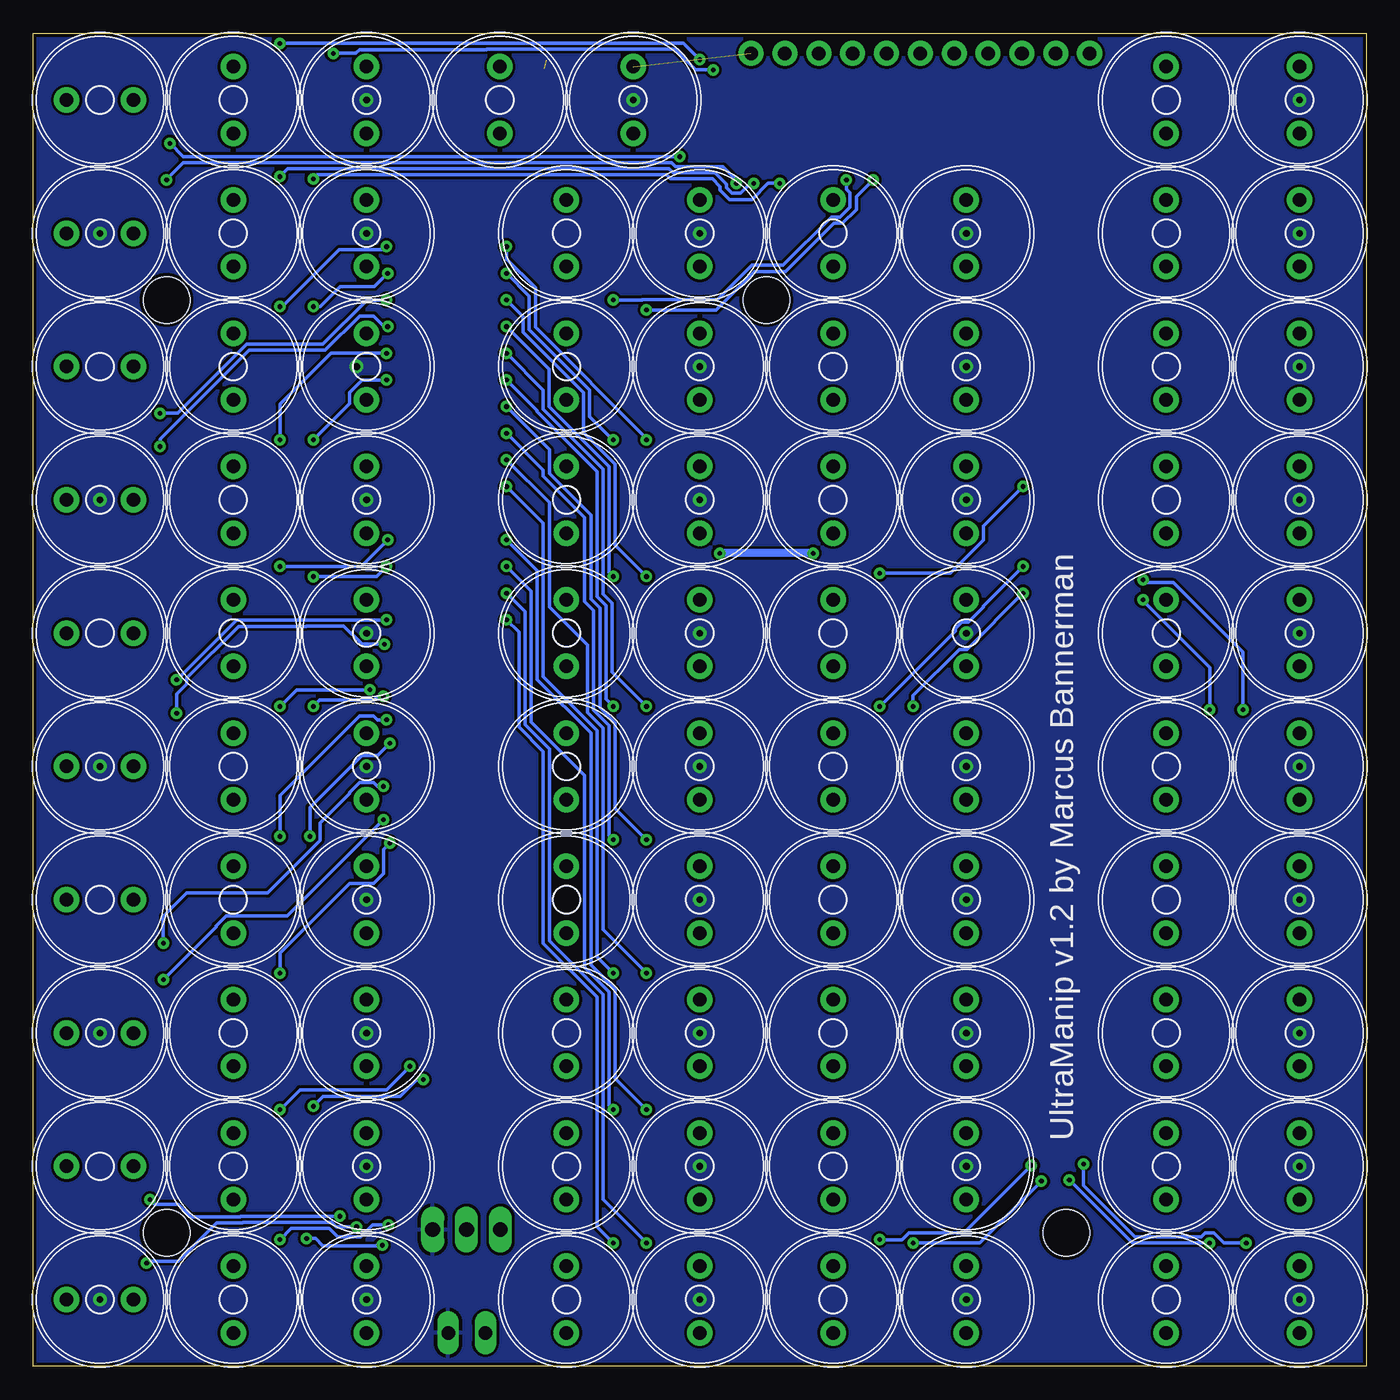
[diagram p3: board, bottom side, seen from below]

Size 100 x 100 mm. Coordinates in mm from the lower left corner, seen from the top.
Outline: 0,0 100,0 100,100 0,100 0,0
Copper layers (1*16): Top 0.035mm / dielectric 1.5mm / Bottom 0.035mm
Design rules "SparkFun *": minimum track width 8mil, minimum drill 0.35mm, track to track 8mil, track to pad 8mil, pad to pad 8mil, via to via 8mil, smd to smd 8mil, copper to edge 10mil, drill to drill 8mil, minimum pad ring 12mil, minimum via ring 10mil, stop-mask expansion 4mil, vias tented up to drill 25mil, thermal gap 10mil
Holes 3.5 mm at 90,10 22.5,10 90,80 45,80

### Footprints (pad centres in the part's own frame; a part is rotated, then mirrored left to right if it is on the bottom)
OKI-78SR-HORIZ = drill 1.118 long: GND 0,0; IN 2.54,0; OUT -2.54,0
1X02_LOCK_LONGPADS = drill 1.016 long: 1 -0.127,0; 2 2.667,0
C0805 = smd 1.3 x 1.5: 1 -0.95,0; 2 0.95,0
1X11 = drill 1.016 pad 1.88: 1 0,0; 2 2.54,0; 3 5.08,0; 4 7.62,0; 5 10.16,0; 6 12.7,0; 7 15.24,0; 8 17.78,0; 9 20.32,0; 10 22.86,0; 11 25.4,0
CORE3S500E-SMT = smd 1 x 2.2: 2 -23,28.4; 3 -23,23.6; 4 -25,28.4; 5 -25,23.6; 161 5,28.4; 162 5,23.6; 163 3,28.4; 164 3,23.6; 165 1,28.4; 167 1,23.6; 168 -1,28.4; 171 -1,23.6; 172 -3,28.4; 177 -3,23.6; 178 -5,28.4; 179 -5,23.6; 180 -7,28.4; 181 -7,23.6; 185 -9,28.4; 186 -9,23.6; 187 -11,28.4; 189 -11,23.6; 190 -13,28.4; 192 -13,23.6; 193 -15,28.4; 196 -15,23.6; 197 -17,28.4; 199 -17,23.6; 200 -19,28.4; 202 -19,23.6; 203 -21,28.4; 205 -21,23.6 | smd 2.2 x 1: 3,3V@1 21.6,19; 3,3V@2 -21.6,19; 5V@1 21.6,-3; 5V@2 -21.6,-3; 8 -26.4,17; 9 -21.6,17; 11 -26.4,15; 12 -21.6,15; 15 -26.4,13; 16 -21.6,13; 18 -26.4,11; 19 -21.6,11; 22 -26.4,9; 23 -21.6,9; 24 -26.4,7; 25 -21.6,7; 28 -26.4,5; 29 -21.6,5; 30 -26.4,3; 31 -21.6,3; 33 -26.4,1; 34 -21.6,1; 35 -26.4,-1; 36 -21.6,-1; 39 -26.4,-5; 40 -21.6,-5; 41 -26.4,-7; 42 -21.6,-7; 45 -26.4,-9; 47 -21.6,-9; 48 -26.4,-11; 49 -21.6,-11; 50 -26.4,-13; 55 -21.6,-13; 60 -26.4,-15; 61 -21.6,-15; 62 -26.4,-17; 63 -21.6,-17; 64 -26.4,-19; 65 -21.6,-19; 69 -26.4,-21; 74 -21.6,-21; 75 -26.4,-23; 76 -21.6,-23; 77 -26.4,-25; 82 -21.6,-25; 90 21.6,-25; 93 26.4,-25; 94 21.6,-23; 96 26.4,-23; 97 21.6,-21; 98 26.4,-21; 99 21.6,-19; 100 26.4,-19; 102 21.6,-17; 106 26.4,-17; 107 21.6,-15; 108 26.4,-15; 109 21.6,-13; 112 26.4,-13; 113 21.6,-11; 115 26.4,-11; 116 21.6,-9; 119 26.4,-9; 120 21.6,-7; 122 26.4,-7; 123 21.6,-5; 126 26.4,-5; 127 21.6,-1; 128 26.4,-1; 129 21.6,1; 132 26.4,1; 133 21.6,3; 134 26.4,3; 135 21.6,5; 137 26.4,5; 138 21.6,7; 139 26.4,7; 140 21.6,9; 144 26.4,9; 145 21.6,11; 146 26.4,11; 147 21.6,13; 150 26.4,13; 151 21.6,15; 152 26.4,15; 153 21.6,17; 160 26.4,17; GND@1 26.4,19; GND@2 -26.4,19; GND@3 26.4,-3; GND@4 -26.4,-3
MA40 = drill 1.016 pad 1.905: + 2.5,0; - -2.5,0
SOIC127P600X175-8N = smd 1.981 x 0.559: 1 -2.362,1.905; 2 -2.362,0.635; 3 -2.362,-0.635; 4 -2.362,-1.905; 5 2.362,-1.905; 6 2.362,-0.635; 7 2.362,0.635; 8 2.362,1.905

### Placement (x,y rotation side)
5V-REG  67.5,10.25 0 top
20V-PWR  68.75,2.5 180 top
C3  7.5,65 270 top
C4  32.5,75 270 top
C5  32.5,65 270 top
C7  77.5,75 270 top
C9  77.5,65 270 top
C10  52.5,75 270 top
C11  95,67.5 0 top
C12  7.5,75 270 top
C13  52.5,65 270 top
C19  7.25,55 270 top
C20  7.5,45 270 top
C21  77.5,55 270 top
C22  77.5,45 270 top
C23  95,47.5 0 top
C24  32.5,55 270 top
C25  32.5,45 270 top
C26  52.5,55 270 top
C27  52.5,45 270 top
C28  7.5,95 270 top
C29  7.5,85 270 top
C30  77.5,95 270 top
C31  77.5,85 270 top
C32  95,87.5 0 top
C34  32.5,85 270 top
C35  57,95 270 top
C36  52.5,85 270 top
C37  7.5,35 270 top
C38  7.5,25 270 top
C39  77.5,35 270 top
C40  77.5,25 270 top
C41  95,27.5 0 top
C42  32.5,35 270 top
C43  32.5,25 270 top
C44  52.5,35 270 top
C45  52.5,25 270 top
C55  7.5,15 270 top
C56  7.5,5 270 top
C57  77.5,15 270 top
C58  77.5,5 270 top
C59  96,7.5 0 top
C60  32.5,15 270 top
C61  32.5,5 270 top
C62  52.5,15 270 top
C63  52.5,5 270 top
DATA  20.75,98.5 0 top
DIP1  45,67 0 top
T1  5,95 270 bottom
T2  15,95 270 bottom
T3  55,95 270 bottom
T4  65,95 270 bottom
T5  75,95 270 bottom
T6  85,95 270 bottom
T7  95,95 180 bottom
T8  5,85 270 bottom
T9  15,85 270 bottom
T10  30,85 270 bottom
T11  40,85 270 bottom
T12  50,85 270 bottom
T13  60,85 270 bottom
T14  75,85 270 bottom
T15  85,85 270 bottom
T16  95,85 180 bottom
T17  5,75 270 bottom
T18  15,75 270 bottom
T19  30,75 270 bottom
T20  40,75 270 bottom
T21  50,75 270 bottom
T22  60,75 270 bottom
T23  75,75 270 bottom
T24  85,75 270 bottom
T25  95,75 180 bottom
T26  5,65 270 bottom
T27  15,65 270 bottom
T28  30,65 270 bottom
T29  40,65 270 bottom
T30  50,65 270 bottom
T31  60,65 270 bottom
T32  75,65 270 bottom
T33  85,65 270 bottom
T34  95,65 180 bottom
T35  5,55 270 bottom
T36  15,55 270 bottom
T37  30,55 270 bottom
T38  40,55 270 bottom
T39  50,55 270 bottom
T40  60,55 270 bottom
T41  75,55 270 bottom
T42  85,55 270 bottom
T43  95,55 180 bottom
T44  5,45 270 bottom
T45  15,45 270 bottom
T46  30,45 270 bottom
T47  40,45 270 bottom
T48  50,45 270 bottom
T49  60,45 270 bottom
T50  75,45 270 bottom
T51  85,45 270 bottom
T52  95,45 180 bottom
T53  5,35 270 bottom
T54  15,35 270 bottom
T55  30,35 270 bottom
T56  40,35 270 bottom
T57  50,35 270 bottom
T58  60,35 270 bottom
T59  75,35 270 bottom
T60  85,35 270 bottom
T61  95,35 180 bottom
T62  5,25 270 bottom
T63  15,25 270 bottom
T64  30,25 270 bottom
T65  40,25 270 bottom
T66  50,25 270 bottom
T67  60,25 270 bottom
T68  75,25 270 bottom
T69  85,25 270 bottom
T70  95,25 180 bottom
T71  5,15 270 bottom
T72  15,15 270 bottom
T73  30,15 270 bottom
T74  40,15 270 bottom
T75  50,15 270 bottom
T76  60,15 270 bottom
T77  75,15 270 bottom
T78  85,15 270 bottom
T79  95,15 180 bottom
T80  5,5 270 bottom
T81  15,5 270 bottom
T82  30,5 270 bottom
T83  40,5 270 bottom
T84  50,5 270 bottom
T85  60,5 270 bottom
T86  75,5 270 bottom
T87  85,5 270 bottom
T88  95,5 180 bottom
U3  11,65 270 top
U4  36,75 270 top
U5  36,65 270 top
U7  81,75 270 top
U9  81,65 270 top
U10  56,75 270 top
U11  95,71 0 top
U12  11,75 270 top
U13  56,65 270 top
U19  11,55 270 top
U20  11,45 270 top
U21  81,55 270 top
U22  81,45 270 top
U23  95,51 0 top
U24  36,55 270 top
U25  36,45 270 top
U26  56,55 270 top
U27  56,45 270 top
U28  11,95 270 top
U29  11,85 270 top
U30  81,95 270 top
U31  81,85 270 top
U32  95,91 0 top
U34  36,85 270 top
U35  61,95 270 top
U36  56,85 270 top
U37  11,35 270 top
U38  11,25 270 top
U39  81,35 270 top
U40  81,25 270 top
U41  95,31 0 top
U42  36,35 270 top
U43  36,25 270 top
U44  56,35 270 top
U45  56,25 270 top
U55  11,15 270 top
U56  11,5 270 top
U57  81,15 270 top
U58  81,5 270 top
U59  96,11 0 top
U60  36,15 270 top
U61  36,5 270 top
U62  56,15 270 top
U63  56,5 270 top

### Tracks (layer width: path | path; a pad name or v marks a point on that pad's centre or on a via)
1
  Top 0.254: U28.4 9.1,95.4 9.55,94.94 18.39,94.94 19.36,93.97 20.64,93.97 20.83,94.16 20.83,94.23 DIP1.2
2
  Top 0.254: DIP1.4 11.63,95.4 U28.2
3
  Top 0.254: DIP1.165 47.17,96.57 47.17,96.64 49.32,98.78 59.09,98.78 U35.4
4  (1 unrouted)
  Top 0.254: 61.5,98 61.46,98 | DIP1.168 45.17,96.57 45.17,96.64 45.76,97.23 46.68,97.23 48.69,99.24 61.63,99.24 U35.2
5  (via drill 0.35)
  Top 0.254: DIP1.163 49,96.4 v49,97.25 | v77.5,98.49 77.97,98.49 U30.4
  Bottom 0.254: v49,97.25 49.01,97.26 50.31,97.26 51.84,98.79 66,98.79 66.01,98.78 75.53,98.78 75.82,98.49 v77.5,98.49
6  (via drill 0.35)
  Top 0.254: DIP1.161 v50,98.02 | v81.5,99.25 81.64,99.11 U30.2
  Bottom 0.254: v50,98.02 51.23,99.25 v81.5,99.25
7  (via drill 0.35)
  Top 0.254: DIP1.162 50.15,90.75 v51.5,90.75 | v89.75,91.75 92.52,91.75 U32.2
  Bottom 0.254: 51.65,90.6 v51.5,90.75 88.75,90.75 v89.75,91.75
8
  Top 0.254: DIP1.196 28.83,91.77 28.83,91.84 28.18,92.49 16.8,92.49 15.53,91.22 11.22,91.22 9.1,89.09 U29.4
9
  Top 0.254: DIP1.199 26.83,91.77 26.83,91.84 26.64,92.03 21.36,92.03 21.33,92 20.67,92 20.64,92.03 16.99,92.03 15.72,90.76 13.5,90.76 11.63,88.89 U29.2
10
  Top 0.254: DIP1.192 32,89.46 U34.4
11
  Top 0.254: 36.63,87.9 U34.2 35.98,88.02 35.98,88.49 35.78,88.68 34.07,88.68 34,88.75 DIP1.189
12
  Top 0.254: DIP1.177 43.17,91.77 43.17,91.84 43.36,92.03 51.29,92.03 54.09,89.23 U36.4
13
  Top 0.254: DIP1.179 41.17,91.77 41.17,91.84 41.82,92.49 51.98,92.49 55.98,88.49 55.98,88.02 U36.2
14  (via drill 0.35)
  Top 0.254: v79,89.08 79.09,88.98 U31.4 | v44,88.75 DIP1.171
  Bottom 0.254: v79,89.08 78.7,89.38 52.49,89.38 52.19,89.08 49.05,89.08 48.47,88.5 48.47,88.25 47.75,87.53 46.08,87.53 44.87,88.75 v44,88.75
15  (via drill 0.35)
  Top 0.254: v81.5,89.25 81.64,89.11 U31.2 | v45.94,88.75 45.94,90.54 DIP1.167
  Bottom 0.254: v81.5,89.25 80.91,89.84 52.31,89.84 52,89.53 48.86,89.53 48.01,88.69 48.01,88.44 47.56,87.99 46.94,87.99 46.18,88.75 v45.94,88.75
16  (via drill 0.35)
  Top 0.254: v90,89 90.09,89.09 U32.4 | v47.25,88.75 48,89.5 DIP1.164
  Bottom 0.254: v90,89 90,89.04 88.75,90.29 52.12,90.29 51.81,89.99 48.24,89.99 47.25,89 v47.25,88.75
17
  Top 0.254: DIP1.11 17.25,82 17.25,81.4 15.31,79.46 11.95,79.46 11.49,79 9.25,79 9.1,78.84 U12.4
18
  Top 0.254: U12.2 11.63,78.5 12.13,79 15.5,79 16.5,80 DIP1.15
19
  Top 0.254: DIP1.19 25.25,78 26.25,79 31.75,79 32.46,78.29 34,78.29 34.09,78.2 U4.4
20
  Top 0.254: U4.2 36.63,78.61 36.5,78.75 32.65,78.75 31.94,79.46 25.29,79.46 24.75,80 DIP1.16
21  (via drill 0.35)
  Top 0.254: DIP1.186 37,89.6 v37,89 | v54,79.25 54.09,79.16 U10.4
  Bottom 0.254: v54,79.25 48.76,79.25 45.88,82.13 43.55,82.13 39.93,85.76 39.28,85.76 38.26,86.78 38.26,87.74 v37,89
22  (via drill 0.35)
  Top 0.254: DIP1.181 39,89.6 v39,89 | v56.5,80 56.63,79.86 U10.2
  Bottom 0.254: v56.5,80 54.32,80 54.31,80.01 48.65,80.01 46.07,82.59 43.75,82.59 | 43.75,82.59 43.74,82.59 | v39,89 39,88.31 38.72,88.03 38.72,86.97 39.47,86.22 40.12,86.22 43.75,82.59
23  (via drill 0.35)
  Top 0.254: DIP1.152 v73.42,82 | v79,79.5 79.09,79.41 U7.4
  Bottom 0.254: v73.42,82 74.42,81 77,81 78.5,79.5 v79,79.5
24  (via drill 0.35)
  Top 0.254: DIP1.160 v73.5,84 | v81.5,79.5 81.64,79.36 U7.2
  Bottom 0.254: v73.5,84 73.72,83.78 77.05,83.78 81.33,79.5 v81.5,79.5
25  (via drill 0.35)
  Top 0.254: DIP1.150 v73.5,80 | v90.5,71.5 92.5,71.5 U11.2
  Bottom 0.254: v73.5,80 74.96,80 78.29,76.67 84.01,76.67 89.19,71.5 v90.5,71.5
26
  Top 0.254: 9,67.46 U3.4 9.76,68.02 9.76,68.49 9.95,68.68 10.93,68.68 11,68.75 11.91,68.75 12.4,69.24 17.84,69.24 DIP1.30
27
  Top 0.254: DIP1.33 17.82,68.78 12.59,68.78 12.06,68.25 11.75,68.25 11.63,68.14 U3.2
28
  Top 0.254: U5.4 34.09,68.78 27.57,68.78 26.35,70 DIP1.31
29
  Top 0.254: U5.2 36.63,69 36.4,69.24 27.76,69.24 25,72 DIP1.29
30  (via drill 0.35)
  Top 0.254: v54,69.5 54.09,69.41 U13.4 | DIP1.153 v64.5,84
  Bottom 0.254: v54,69.5 54,69.61 62.34,77.94 62.34,80.91 64.5,83.07 v64.5,84
31  (via drill 0.35)
  Top 0.254: DIP1.151 v64.5,82 | v56.5,69.5 56.5,67.5 U13.2
  Bottom 0.254: v56.5,69.5 58.26,71.26 58.26,73.22 62.79,77.75 62.79,80.29 v64.5,82
32  (via drill 0.35)
  Top 0.254: DIP1.139 v73.5,74 | v79,69.5 79.09,69.41 U9.4
  Bottom 0.254: v79,69.5 76.28,72.22 76.28,73.03 75.31,74 v73.5,74
33  (via drill 0.35)
  Top 0.254: DIP1.144 v73.5,76 | v81.5,69.5 81.64,69.36 U9.2
  Bottom 0.254: v73.5,76 77.67,76 81.5,72.17 v81.5,69.5
34  (via drill 0.35)
  Top 0.254: DIP1.146 v73.42,78 | v90.5,69 92.64,69 U11.4
  Bottom 0.254: v73.42,78 73.69,78 74.47,78.78 75.53,78.78 78.1,76.22 83.82,76.22 90.5,69.54 v90.5,69
35
  Top 0.254: DIP1.35 17.43,64.83 17.36,64.83 17.17,64.64 17.17,61.28 15.34,59.46 11.21,59.46 10.5,58.75 10.02,58.75 9.76,58.49 9.76,58.02 U19.4
36
  Top 0.254: U19.2 11.63,58.88 11.75,59 15.53,59 17.36,60.83 17.43,60.83 DIP1.39
37
  Top 0.254: DIP1.40 24.57,60.83 25.99,60.83 27.82,59 34.09,59 U24.4
38  (via drill 0.35)
  Top 0.254: DIP1.36 v25.75,66 | v36.5,59.5 36.63,59.37 U24.2
  Bottom 0.254: v25.75,66 28.72,63.03 28.72,61.97 31.19,59.5 v36.5,59.5
39  (via drill 0.35)
  Top 0.254: U26.4 54.09,59.25 v54,59.25 | DIP1.147 v64.5,80
  Bottom 0.254: v54,59.25 56.34,61.59 56.34,67.68 58.72,70.05 58.72,73.03 63.25,77.56 63.25,78.75 v64.5,80
40  (via drill 0.35)
  Top 0.254: DIP1.145 v64.5,78 | U26.2 56.5,57.5 v56.5,59.25
  Bottom 0.254: 64.2,78 v64.5,78 61.29,74.79 61.29,71.98 60.66,71.34 | 60.66,71.34 60.53,71.22 | v56.5,59.25 56.8,59.55 56.8,67.49 60.66,71.34
41  (via drill 0.35)
  Top 0.254: DIP1.122 v73.5,60 | v79,59.24 79.09,59.15 U21.4
  Bottom 0.254: v73.5,60 74.26,59.24 v79,59.24
42  (via drill 0.35)
  Top 0.254: DIP1.126 v73.42,62 | v81.5,60 81.64,59.87 U21.2
  Bottom 0.254: v73.42,62 75.42,60 v81.5,60
43  (via drill 0.35)
  Top 0.254: 92.64,51.75 U23.2 92.5,51.5 v89.25,51.5 | DIP1.119 71.5,58 v73.5,56
  Bottom 0.254: v73.5,56 84.75,56 v89.25,51.5
44  (via drill 0.35)
  Top 0.254: v9.25,49.25 9.1,49.09 U20.4 | DIP1.41 17.75,60 v16.75,59
  Bottom 0.254: v9.25,49.25 9.25,53.56 14.47,58.78 16.53,58.78 v16.75,59
45  (via drill 0.35)
  Top 0.254: v11.75,49.25 11.63,49.13 U20.2 | v16.75,57.5 17.25,58 DIP1.45
  Bottom 0.254: v11.75,49.25 11.75,52.44 16.75,57.44 v16.75,57.5
46  (via drill 0.35)
  Top 0.254: DIP1.47 v25.75,58 | v34,49.5 34.09,49.41 U25.4
  Bottom 0.254: v25.75,58 29.97,53.78 30.53,53.78 34,50.31 v34,49.5
47  (via drill 0.35)
  Top 0.254: DIP1.42 v25.75,60 | v36.5,49.5 36.63,49.37 U25.2
  Bottom 0.254: v25.75,60 28.72,57.03 28.72,56.97 29.85,55.83 30.35,55.83 30.83,55.35 30.83,55.17 v36.5,49.5
48  (via drill 0.35)
  Top 0.254: DIP1.140 v64.5,76 | v54,49.5 54,47.46 U27.4
  Bottom 0.254: v64.5,76 61.75,73.25 61.75,71.79 57.26,67.3 57.26,58 | 57.26,58 57.26,57.95 | v54,49.5 56.59,52.09 56.59,57.27 57.26,57.95 | 57.26,57.95 57.26,58
49  (via drill 0.35)
  Top 0.254: DIP1.138 v64.5,74 | v56.5,49.5 56.5,47.5 U27.2
  Bottom 0.254: v64.5,74 62.21,71.71 62.21,71.6 57.72,67.11 57.72,57.76 57.04,57.08 57.04,50.04 v56.5,49.5
50  (via drill 0.35)
  Top 0.254: v79,49.5 79.09,49.41 U22.4 | DIP1.108 72,52 v73.75,50.25
  Bottom 0.254: 78.88,49.62 78.81,49.69 | 78.88,49.62 v79,49.5 | v73.75,50.25 74.18,50.25 74.44,49.99 78.51,49.99 78.88,49.62
51  (via drill 0.35)
  Top 0.254: DIP1.112 72.57,52.83 72.64,52.83 74.72,50.75 v74.75,50.75 | v81.5,49.5 81.64,49.37 U22.2
  Bottom 0.254: v74.75,50.75 80.25,50.75 v81.5,49.5
52  (via drill 0.35)
  Top 0.254: v89.25,49 89.34,49.09 U23.4 | v73.67,54.17 71.83,56 DIP1.115
  Bottom 0.254: 73.5,54 v73.67,54.17 75.35,54.17 76.72,55.54 79.5,55.54 79.54,55.5 84.6,55.5 88.49,51.61 88.49,51.19 89.25,50.43 v89.25,49
53
  Top 0.254: U37.4 9,37.46 9.76,38.21 9.76,38.49 9.95,38.68 11.84,38.68 13.33,40.17 16.48,40.17 16.71,40.4 16.71,54.18 18.53,56 DIP1.48
54
  Top 0.254: U37.2 12.29,38.02 12.29,38.49 13.52,39.71 17.17,39.71 17.17,52.64 18.53,54 DIP1.50
55
  Top 0.254: U42.4 34.09,38.78 29.97,38.78 27.12,41.63 27.12,50.35 23.47,54 DIP1.55
56
  Top 0.254: U42.2 36.63,39.45 29.95,39.45 27.57,41.82 27.57,51.89 23.47,56 DIP1.49
57  (via drill 0.35)
  Top 0.254: DIP1.135 v64.5,72 | v54,39.5 54,37.46 U44.4
  Bottom 0.254: v64.5,72 61.28,68.78 61.28,66.97 58.17,63.86 58.17,57.57 57.5,56.89 57.5,49.43 56.34,48.27 56.34,41.84 v54,39.5
58  (via drill 0.35)
  Top 0.254: DIP1.133 v64.5,70 | v56.5,39.5 56.5,37.5 U44.2
  Bottom 0.254: v64.5,70 61.74,67.24 61.74,66.78 58.63,63.67 58.63,57.38 57.96,56.7 57.96,49.24 56.8,48.08 56.8,39.8 v56.5,39.5
59  (via drill 0.35)
  Top 0.254: v73.25,46.75 72.72,46.75 72.64,46.83 72.57,46.83 DIP1.100 | U39.4 79.25,37.52 v79.25,39.75
  Bottom 0.254: v73.25,46.75 74.17,45.83 75.35,45.83 79.25,41.93 v79.25,39.75
60  (via drill 0.35)
  Top 0.254: DIP1.106 72.57,48.83 72.64,48.83 72.97,48.5 v73.5,48.5 | v81.5,39.75 81.64,39.75 U39.2
  Bottom 0.254: v73.5,48.5 74.19,48.5 74.47,48.78 75.53,48.78 81.5,42.81 v81.5,39.75
61  (via drill 0.35)
  Top 0.254: DIP1.98 72.57,44.83 72.64,44.83 73.75,43.72 v73.75,43.5 | v90.25,31.75 90.36,31.64 U41.2
  Bottom 0.254: v73.75,43.5 74.19,43.5 74.47,43.78 75.53,43.78 76.28,43.03 76.28,42.97 78.49,40.76 78.49,39.44 82.43,35.5 88.5,35.5 90.25,33.75 v90.25,31.75
62
  Top 0.254: U38.4 9.76,28.02 9.76,28.25 | 9.76,28.25 9.76,28.49 | DIP1.77 19.68,40.92 19.68,33.33 15.59,29.24 12.4,29.24 11.84,28.68 9.95,28.68 9.76,28.49 | 9.76,28.49 9.76,28.25
63
  Top 0.254: U38.2 12.29,28.02 12.29,28.49 12.59,28.78 15.78,28.78 20.14,33.14 20.14,43.86 20,44 DIP1.75
64
  Top 0.254: U43.4 34.09,28.78 27.92,28.78 26.2,30.5 26.2,47.27 23.47,50 DIP1.63
65
  Top 0.254: U43.2 36.63,29.3 28.05,29.3 26.66,30.69 26.66,48.81 23.47,52 DIP1.61
66  (via drill 0.35)
  Top 0.254: DIP1.129 v64.5,68 | U45.4 54.09,29.41 v54,29.5
  Bottom 0.254: v64.5,68 61.28,64.78 61.28,56.97 58.41,54.1 58.41,49.05 57.26,47.89 57.26,32.76 v54,29.5
67  (via drill 0.35)
  Top 0.254: U45.2 56.63,29.36 v56.5,29.5 | v64.5,66 DIP1.127
  Bottom 0.254: v64.5,66 61.74,63.24 61.74,51.73 61.26,51.24 | 61.26,51.24 61.28,51.27 | 61.26,51.24 57.72,47.7 57.72,30.72 v56.5,29.5
68
  Top 0.254: U40.4 75.24,31.22 74.47,31.22 69.97,35.72 69.97,54 DIP1.109
69  (via drill 0.35)
  Top 0.254: DIP1.93 73.25,40.15 v73.25,39.25 | v81.5,29.5 81.64,29.36 U40.2
  Bottom 0.254: v81.5,29.5 81.5,31 76.28,36.22 74.47,36.22 73.72,36.97 73.72,38.78 v73.25,39.25
70  (via drill 0.35)
  Top 0.254: DIP1.96 72.57,42.83 72.64,42.83 73.75,41.72 v73.75,41 | v90.25,29 92.54,29 U41.4
  Bottom 0.254: v73.75,41 80.97,33.78 85.53,33.78 86.28,33.03 86.28,32.97 v90.25,29
71
  Top 0.254: DIP1.69 20,46 20.6,45.4 20.6,24 16.06,19.46 12.62,19.46 11.84,18.68 9.95,18.68 9.76,18.49 9.76,18.02 U55.4
72
  Top 0.254: DIP1.64 20,48 21.05,46.95 21.05,23.8 16.25,19 12.81,19 12.29,18.49 12.29,18.02 U55.2
73
  Top 0.254: U60.4 34.09,18.78 28.25,18.78 25.29,21.75 25.29,44.18 23.47,46 DIP1.74
74
  Top 0.254: U60.2 36.63,19.24 28.44,19.24 25.75,21.94 25.75,45.72 23.47,48 DIP1.65
75  (via drill 0.35)
  Top 0.254: DIP1.123 v64.5,62 | U62.4 54.09,19.16 v54,19.25
  Bottom 0.254: v64.5,62 62.2,59.7 62.2,51.54 58.17,47.51 58.17,30.1 56.34,28.27 56.34,21.59 v54,19.25
76  (via drill 0.35)
  Top 0.254: DIP1.120 v64.5,60 | U62.2 56.63,19.11 v56.5,19.25
  Bottom 0.254: v64.5,60 62.65,58.15 62.65,48.34 58.63,44.32 58.63,29.91 56.8,28.08 56.8,19.55 v56.5,19.25
77  (via drill 0.35)
  Top 0.254: v70.75,21.5 70.12,21.5 69.06,22.56 69.06,50 DIP1.102 | U57.4 79.09,19.41 v79,19.5
  Bottom 0.254: v79,19.5 78.25,20.25 72.5,20.25 71.25,21.5 v70.75,21.5
78  (via drill 0.35)
  Top 0.254: v81.5,19.25 81.64,19.25 U57.2 | v71.75,22.5 71.5,22.75 69.51,22.75 69.51,52 DIP1.107
  Bottom 0.254: v71.75,22.5 73.5,20.75 80,20.75 v81.5,19.25
79  (via drill 0.35)
  Top 0.254: v91.25,12.5 92.11,11.63 U59.2 | v77,11.25 76.97,11.22 74.47,11.22 68.6,17.09 68.6,48 DIP1.99
  Bottom 0.254: v77,11.25 84.44,11.25 84.47,11.22 88.2,11.22 89.12,12.13 90.88,12.13 v91.25,12.5
80  (via drill 0.35)
  Top 0.254: DIP1.62 20,50 21.51,48.49 21.51,15.16 v21.21,15.16 | U56.4 9,7.46 v9,9.25
  Bottom 0.254: v9,9.25 10.68,9.25 11.44,10.01 12.06,10.01 12.37,9.71 17.36,9.71 21.21,13.55 v21.21,15.16
81  (via drill 0.35)
  Top 0.254: DIP1.60 20,52 21.97,50.03 21.97,14 | 21.97,14 21.97,13.97 | U56.2 11.75,7.48 v11.75,9.25 | v22.27,13.97 22,13.97 21.97,14
  Bottom 0.254: v11.75,9.25 17.55,9.25 v22.27,13.97
82  (via drill 0.35)
  Top 0.254: DIP1.82 24.37,41.03 v24.37,13.88 | U61.4 34.09,9.25 v34,9.25
  Bottom 0.254: v24.37,13.88 29,9.25 v34,9.25
83  (via drill 0.35)
  Top 0.254: DIP1.76 23.47,44 24.83,42.64 24.83,15.07 v25.13,15.07 | U61.2 36.63,9.5 v36.5,9.5
  Bottom 0.254: v36.5,9.5 34.82,9.5 34.31,10.01 30.19,10.01 v25.13,15.07
84  (via drill 0.35)
  Top 0.254: DIP1.116 v64.5,58 | U63.4 54.09,9.15 v54,9.25
  Bottom 0.254: v64.5,58 63.11,56.61 63.11,48.15 61.28,46.32 61.28,31.92 57.26,27.89 57.26,12.51 v54,9.25
85  (via drill 0.35)
  Top 0.254: DIP1.113 v64.5,56 | U63.2 56.63,9.12 v56.5,9.25
  Bottom 0.254: v64.5,56 63.57,55.07 63.57,47.96 61.74,46.13 61.74,31.73 57.72,27.7 57.72,10.47 v56.5,9.25
86  (via drill 0.35)
  Top 0.254: DIP1.94 65.43,42.83 65.36,42.83 65.17,42.64 65.17,41.36 67.23,39.31 67.23,16.52 72.6,11.15 72.6,10.29 v73.82,9.07 | v79.5,9.58 79.09,9.17 U58.4
  Bottom 0.254: v73.82,9.07 74.25,9.07 74.28,9.04 78.29,9.04 78.83,9.58 v79.5,9.58
87  (via drill 0.35)
  Top 0.254: DIP1.90 66.6,41.65 67.68,40.57 67.68,16.71 73.36,11.04 v73.36,10.61 | v81.5,9.5 81.64,9.37 U58.2
  Bottom 0.254: v73.36,10.61 74.53,10.61 75.44,9.7 77.17,9.7 77.81,10.34 80.66,10.34 v81.5,9.5
88  (via drill 0.35)
  Top 0.254: v91.5,7.75 92.84,9.1 U59.4 | v75.75,10.46 75.45,10.76 74.28,10.76 68.14,16.9 68.14,44.5 | 68.14,44.5 68.14,44.53 | DIP1.97 68.02,46 68.14,45.88 68.14,44.5
  Bottom 0.254: v75.75,10.46 77.28,10.46 77.62,10.79 84.25,10.79 84.28,10.76 86.23,10.76 89.12,7.87 91.38,7.87 v91.5,7.75
+5V  (via drill 0.35)
  Top 0.61: DIP1.5V@2 26.43,64 29.39,61.04 41.46,61.04 v41.5,61 | 5V-REG.OUT 64.96,37.79 62.75,40 62.75,61 | 62.75,61 v48.5,61 | 62.75,61 62.75,64 DIP1.5V@1
  Bottom 0.61: v41.5,61 v48.5,61
GND  (1 unrouted)
  pour Top (rank 2): 0,0 100,0 100,100 0,100
N$1
  Top 0.254: DATA.1 22.42,96.83 22.64,96.83 22.83,96.64 22.83,96.57 DIP1.203
N$2
  Top 0.254: DIP1.200 DATA.2
N$3
  Top 0.254: DIP1.197 DATA.3
N$4
  Top 0.254: DIP1.193 DATA.4
N$5
  Top 0.508: T27.+ 13.41,64.09 11.63,64.09 U3.7
N$6
  Top 0.508: U3.5 5,62.64 T26.+
N$7
  Top 0.508: T20.+ 38.41,74.09 36.63,74.09 U4.7
N$8
  Top 0.508: U4.5 30,72.64 T19.+
N$9
  Top 0.508: T29.+ 38.41,64.09 36.63,64.09 U5.7
N$10
  Top 0.508: U5.5 30,62.64 T28.+
N$13
  Top 0.254: DIP1.190 DATA.5
N$14
  Top 0.254: DIP1.187 DATA.6
N$15
  Top 0.508: T24.+ 83.41,74.09 81.64,74.09 U7.7
N$16
  Top 0.508: U7.5 75,72.64 T23.+
N$17
  Top 0.254: DIP1.185 DATA.7
N$18
  Top 0.254: DIP1.180 DATA.8
N$19
  Top 0.508: T33.+ 83.41,64.09 81.64,64.09 U9.7
N$20
  Top 0.508: U9.5 75,62.64 T32.+
N$21
  Top 0.508: T22.+ 58.41,74.09 56.63,74.09 U10.7
N$22
  Top 0.508: U10.5 50,72.64 T21.+
N$23
  Top 0.508: T25.+ 95.91,73.41 95.91,71.64 U11.7
N$24
  Top 0.508: U11.5 97.36,65 T34.+
N$25
  Top 0.508: T18.+ 13.41,74.09 11.63,74.09 U12.7
N$26
  Top 0.508: U12.5 5,72.64 T17.+
N$27
  Top 0.508: T31.+ 58.41,64.09 56.63,64.09 U13.7
N$28
  Top 0.508: U13.5 50,62.64 T30.+
N$29
  Top 0.254: DIP1.178 DATA.9
N$30
  Top 0.254: DIP1.172 DATA.10
N$39
  Top 0.508: T36.+ 13.41,54.09 11.63,54.09 U19.7
N$40
  Top 0.508: U19.5 5,52.64 T35.+
N$41
  Top 0.508: T45.+ 13.41,44.09 11.63,44.09 U20.7
N$42
  Top 0.508: U20.5 5,42.64 T44.+
N$43
  Top 0.508: T42.+ 83.41,54.09 81.64,54.09 U21.7
N$44
  Top 0.508: U21.5 75,52.64 T41.+
N$45
  Top 0.508: T51.+ 83.41,44.09 81.64,44.09 U22.7
N$46
  Top 0.508: U22.5 75,42.64 T50.+
N$47
  Top 0.508: T43.+ 95.91,53.41 95.91,51.63 U23.7
N$48
  Top 0.508: U23.5 97.36,45 T52.+
N$49
  Top 0.508: T38.+ 38.41,54.09 36.63,54.09 U24.7
N$50
  Top 0.508: U24.5 30,52.64 T37.+
N$51
  Top 0.508: T47.+ 38.41,44.09 36.63,44.09 U25.7
N$52
  Top 0.508: U25.5 30,42.64 T46.+
N$53
  Top 0.508: T40.+ 58.41,54.09 56.63,54.09 U26.7
N$54
  Top 0.508: U26.5 50,52.64 T39.+
N$55
  Top 0.508: T49.+ 58.41,44.09 56.63,44.09 U27.7
N$56
  Top 0.508: U27.5 50,42.64 T48.+
N$57
  Top 0.508: T2.+ 13.41,94.09 11.63,94.09 U28.7
N$58
  Top 0.508: U28.5 5,92.64 T1.+
N$59
  Top 0.508: T9.+ 13.41,84.09 11.63,84.09 U29.7
N$60
  Top 0.508: U29.5 5,82.64 T8.+
N$61
  Top 0.508: T6.+ 83.41,94.09 81.64,94.09 U30.7
N$62
  Top 0.508: U30.5 75,92.64 T5.+
N$63
  Top 0.508: T15.+ 83.41,84.09 81.64,84.09 U31.7
N$64
  Top 0.508: U31.5 75,82.64 T14.+
N$65
  Top 0.508: T7.+ 95.91,93.41 95.91,91.64 U32.7
N$66
  Top 0.508: U32.5 97.36,85 T16.+
N$69
  Top 0.508: T11.+ 38.41,84.09 36.63,84.09 U34.7
N$70
  Top 0.508: U34.5 30,82.64 T10.+
N$71
  Top 0.508: T4.+ 63.41,94.09 61.63,94.09 U35.7
N$72
  Top 0.508: U35.5 55,92.64 T3.+
N$73
  Top 0.508: T13.+ 58.41,84.09 56.63,84.09 U36.7
N$74
  Top 0.508: U36.5 50,82.64 T12.+
N$75
  Top 0.508: T54.+ 13.41,34.09 11.63,34.09 U37.7
N$76
  Top 0.508: U37.5 5,32.64 T53.+
N$77
  Top 0.508: T63.+ 13.41,24.09 11.63,24.09 U38.7
N$78
  Top 0.508: U38.5 5,22.64 T62.+
N$79
  Top 0.508: T60.+ 83.41,34.09 81.64,34.09 U39.7
N$80
  Top 0.508: U39.5 75,32.64 T59.+
N$81
  Top 0.508: T69.+ 83.41,24.09 81.64,24.09 U40.7
N$82
  Top 0.508: U40.5 75,22.64 T68.+
N$83
  Top 0.508: T61.+ 95.91,33.41 95.91,31.64 U41.7
N$84
  Top 0.508: U41.5 97.36,25 T70.+
N$85
  Top 0.508: T56.+ 38.41,34.09 36.63,34.09 U42.7
N$86
  Top 0.508: U42.5 30,32.64 T55.+
N$87
  Top 0.508: T65.+ 38.41,24.09 36.63,24.09 U43.7
N$88
  Top 0.508: U43.5 30,22.64 T64.+
N$89
  Top 0.508: T58.+ 58.41,34.09 56.63,34.09 U44.7
N$90
  Top 0.508: U44.5 50,32.64 T57.+
N$91
  Top 0.508: T67.+ 58.41,24.09 56.63,24.09 U45.7
N$92
  Top 0.508: U45.5 50,22.64 T66.+
N$111
  Top 0.508: T72.+ 13.41,14.09 11.63,14.09 U55.7
N$112
  Top 0.508: U55.5 5,12.64 T71.+
N$113
  Top 0.508: T81.+ 13.41,4.09 11.63,4.09 U56.7
N$114
  Top 0.508: U56.5 5,2.64 T80.+
N$115
  Top 0.508: T78.+ 83.41,14.09 81.64,14.09 U57.7
N$116
  Top 0.508: U57.5 75,12.64 T77.+
N$117
  Top 0.508: T87.+ 83.41,4.09 81.64,4.09 U58.7
N$118
  Top 0.508: U58.5 75,2.64 T86.+
N$119
  Top 0.508: T79.+ 97.5,13.96 96.91,13.37 96.91,12.44 97.72,11.63 U59.7
N$120
  Top 0.508: 97.36,5 T88.+ 98.36,5 U59.5
N$121
  Top 0.508: T74.+ 38.41,14.09 36.63,14.09 U60.7
N$122
  Top 0.508: U60.5 30,12.64 T73.+
N$123
  Top 0.508: T83.+ 38.41,4.09 36.63,4.09 U61.7
N$124
  Top 0.508: U61.5 30,2.64 T82.+
N$125
  Top 0.508: T76.+ 58.41,14.09 56.63,14.09 U62.7
N$126
  Top 0.508: U62.5 50,12.64 T75.+
N$127
  Top 0.508: T85.+ 58.41,4.09 56.63,4.09 U63.7
N$128
  Top 0.508: U63.5 50,2.64 T84.+
VDD  (via drill 0.5, 0.5 pad 0.7)
  Top 0.508: U12.6 10.37,73.28 9.56,74.09 8.63,74.09 8.59,74.05 C12.2 6.71,74.84 6.56,74.84 6.4,75 v5,75 | U3.6 10.37,63.28 9.56,64.09 8.63,64.09 8.59,64.05 C3.2 6.71,64.84 6.56,64.84 6.4,65 v5,65 | U7.6 80.36,73.28 79.56,74.09 78.63,74.09 78.59,74.05 C7.2 76.71,74.84 76.56,74.84 76.4,75 v75.75,75 | U9.6 80.36,63.28 79.56,64.09 78.63,64.09 78.59,64.05 C9.2 76.71,64.84 76.56,64.84 76.4,65 v75,65 | U11.6 96.72,70.36 95.91,69.56 95.91,68.63 95.95,68.59 C11.2 95.16,66.71 95.16,66.56 95,66.4 v95,65 | U4.6 35.37,73.28 34.56,74.09 33.63,74.09 33.59,74.05 C4.2 31.71,74.84 31.56,74.84 31.4,75 v30,75 | U5.6 35.37,63.28 34.56,64.09 33.63,64.09 33.59,64.05 C5.2 31.71,64.84 31.56,64.84 31.4,65 v30,65 | U10.6 55.37,73.28 54.56,74.09 53.63,74.09 53.59,74.05 C10.2 51.71,74.84 51.56,74.84 51.4,75 v50,75 | U13.6 55.37,63.28 54.56,64.09 53.63,64.09 53.59,64.05 C13.2 51.71,64.84 51.56,64.84 51.4,65 v50,65 | U19.6 10.37,53.28 9.56,54.09 8.63,54.09 8.59,54.05 C19.2 5.95,54.05 v5,55 | U20.6 10.37,43.28 9.56,44.09 8.63,44.09 8.59,44.05 C20.2 6.71,44.84 6.56,44.84 6.4,45 v5,45 | U21.6 80.36,53.28 79.56,54.09 78.63,54.09 78.59,54.05 C21.2 76.71,54.84 76.56,54.84 76.4,55 v75,55 | U22.6 80.36,43.28 79.56,44.09 78.63,44.09 78.59,44.05 C22.2 76.71,44.84 76.56,44.84 76.4,45 v75,45 | U23.6 96.72,50.37 95.91,49.56 95.91,48.63 95.95,48.59 C23.2 95.16,46.71 95.16,46.56 95,46.4 v95,45 | U24.6 35.37,53.28 34.56,54.09 33.63,54.09 33.59,54.05 C24.2 31.71,54.84 31.56,54.84 31.4,55 v30,55 | U25.6 35.37,43.28 34.56,44.09 33.63,44.09 33.59,44.05 C25.2 31.71,44.84 31.56,44.84 31.4,45 v30,45
  Top 0.508: U26.6 55.37,53.28 54.56,54.09 53.63,54.09 53.59,54.05 C26.2 51.71,54.84 51.56,54.84 51.4,55 v50,55 | U27.6 55.37,43.28 54.56,44.09 53.63,44.09 53.59,44.05 C27.2 51.71,44.84 51.56,44.84 51.4,45 v50,45 | U37.6 10.37,33.28 9.56,34.09 8.63,34.09 8.59,34.05 C37.2 6.71,34.84 6.56,34.84 6.4,35 v5,35 | U38.6 10.37,23.28 9.56,24.09 8.63,24.09 8.59,24.05 C38.2 6.71,24.84 6.56,24.84 6.4,25 v5,25 | U39.6 80.36,33.28 79.56,34.09 78.63,34.09 78.59,34.05 C39.2 76.71,34.84 76.56,34.84 76.4,35 v75,35 | U40.6 80.36,23.28 79.56,24.09 78.63,24.09 78.59,24.05 C40.2 76.71,24.84 76.56,24.84 76.4,25 v75,25 | U41.6 96.72,30.36 95.91,29.56 95.91,28.63 95.95,28.59 C41.2 95.16,26.71 95.16,26.56 95,26.4 v95,25 | U42.6 35.37,33.28 34.56,34.09 33.63,34.09 33.59,34.05 C42.2 31.71,34.84 31.56,34.84 31.4,35 v30,35 | U43.6 35.37,23.28 34.56,24.09 33.63,24.09 33.59,24.05 C43.2 31.71,24.84 31.56,24.84 31.4,25 v30,25 | U44.6 55.37,33.28 54.56,34.09 53.63,34.09 53.59,34.05 C44.2 51.71,34.84 51.56,34.84 51.4,35 v50,35 | U45.6 55.37,23.28 54.56,24.09 53.63,24.09 53.59,24.05 C45.2 51.71,24.84 51.56,24.84 51.4,25 v50,25 | U55.6 10.37,13.28 9.56,14.09 8.63,14.09 8.59,14.05 C55.2 6.71,14.84 6.56,14.84 6.4,15 v5,15 | U56.6 10.37,3.28 9.56,4.09 8.63,4.09 8.59,4.05 C56.2 6.71,4.84 6.56,4.84 6.4,5 v5,5 | U57.6 80.36,13.28 79.56,14.09 78.63,14.09 78.59,14.05 C57.2 76.71,14.84 76.56,14.84 76.4,15 v75,15 | U58.6 80.36,3.28 79.56,4.09 78.63,4.09 78.59,4.05 C58.2 76.71,4.84 76.56,4.84 76.4,5 v75,5 | U60.6 35.37,13.28 34.56,14.09 33.63,14.09 33.59,14.05 C60.2 31.71,14.84 31.56,14.84 31.4,15 v30,15
  Top 0.508: U61.6 35.37,3.28 34.56,4.09 33.63,4.09 33.59,4.05 C61.2 31.71,4.84 31.56,4.84 31.4,5 v30,5 | U62.6 55.37,13.28 54.56,14.09 53.63,14.09 53.59,14.05 C62.2 51.71,14.84 51.56,14.84 51.4,15 v50,15 | U63.6 55.37,3.28 54.56,4.09 53.63,4.09 53.59,4.05 C63.2 51.71,4.84 51.56,4.84 51.4,5 v50,5 | U28.6 10.37,93.28 9.56,94.09 8.63,94.09 8.59,94.05 C28.2 6.71,94.84 6.56,94.84 6.4,95 v5,95 | U29.6 10.37,83.28 9.56,84.09 8.63,84.09 8.59,84.05 C29.2 6.71,84.84 6.56,84.84 6.4,85 v5,85 | U30.6 80.36,93.28 79.56,94.09 78.63,94.09 78.59,94.05 C30.2 76.71,94.84 76.56,94.84 76.4,95 v75,95 | U31.6 80.36,83.28 79.56,84.09 78.63,84.09 78.59,84.05 C31.2 76.71,84.84 76.56,84.84 76.4,85 v75,85 | U32.6 96.72,90.36 95.91,89.56 95.91,88.63 95.95,88.59 C32.2 95.16,86.71 95.16,86.56 95,86.4 v95,85 | U34.6 35.37,83.28 34.56,84.09 33.63,84.09 33.59,84.05 C34.2 31.71,84.84 31.56,84.84 31.4,85 v30,85 | U35.6 60.37,93.28 59.56,94.09 58.63,94.09 58.59,94.05 C35.2 55.95,94.05 v55,95 | U36.6 55.37,83.28 54.56,84.09 53.63,84.09 53.59,84.05 C36.2 51.71,84.84 51.56,84.84 51.4,85 v50,85 | U59.6 97.72,10.37 96.91,9.56 96.91,8.63 96.95,8.59 C59.2 96.95,6.41 96.92,6.41 95.51,5 v95,5
  pour Bottom: 0,100 100,100 100,0 0,0

### Text on the board
tPlace: UltraManip v1.2 by Marcus Bannerman | - | +
bPlace: UltraManip v1.2 by Marcus Bannerman